# EAGLE design ww101board (EAGLE 8.3.2)

## Sheet 1 of 4: User Interface
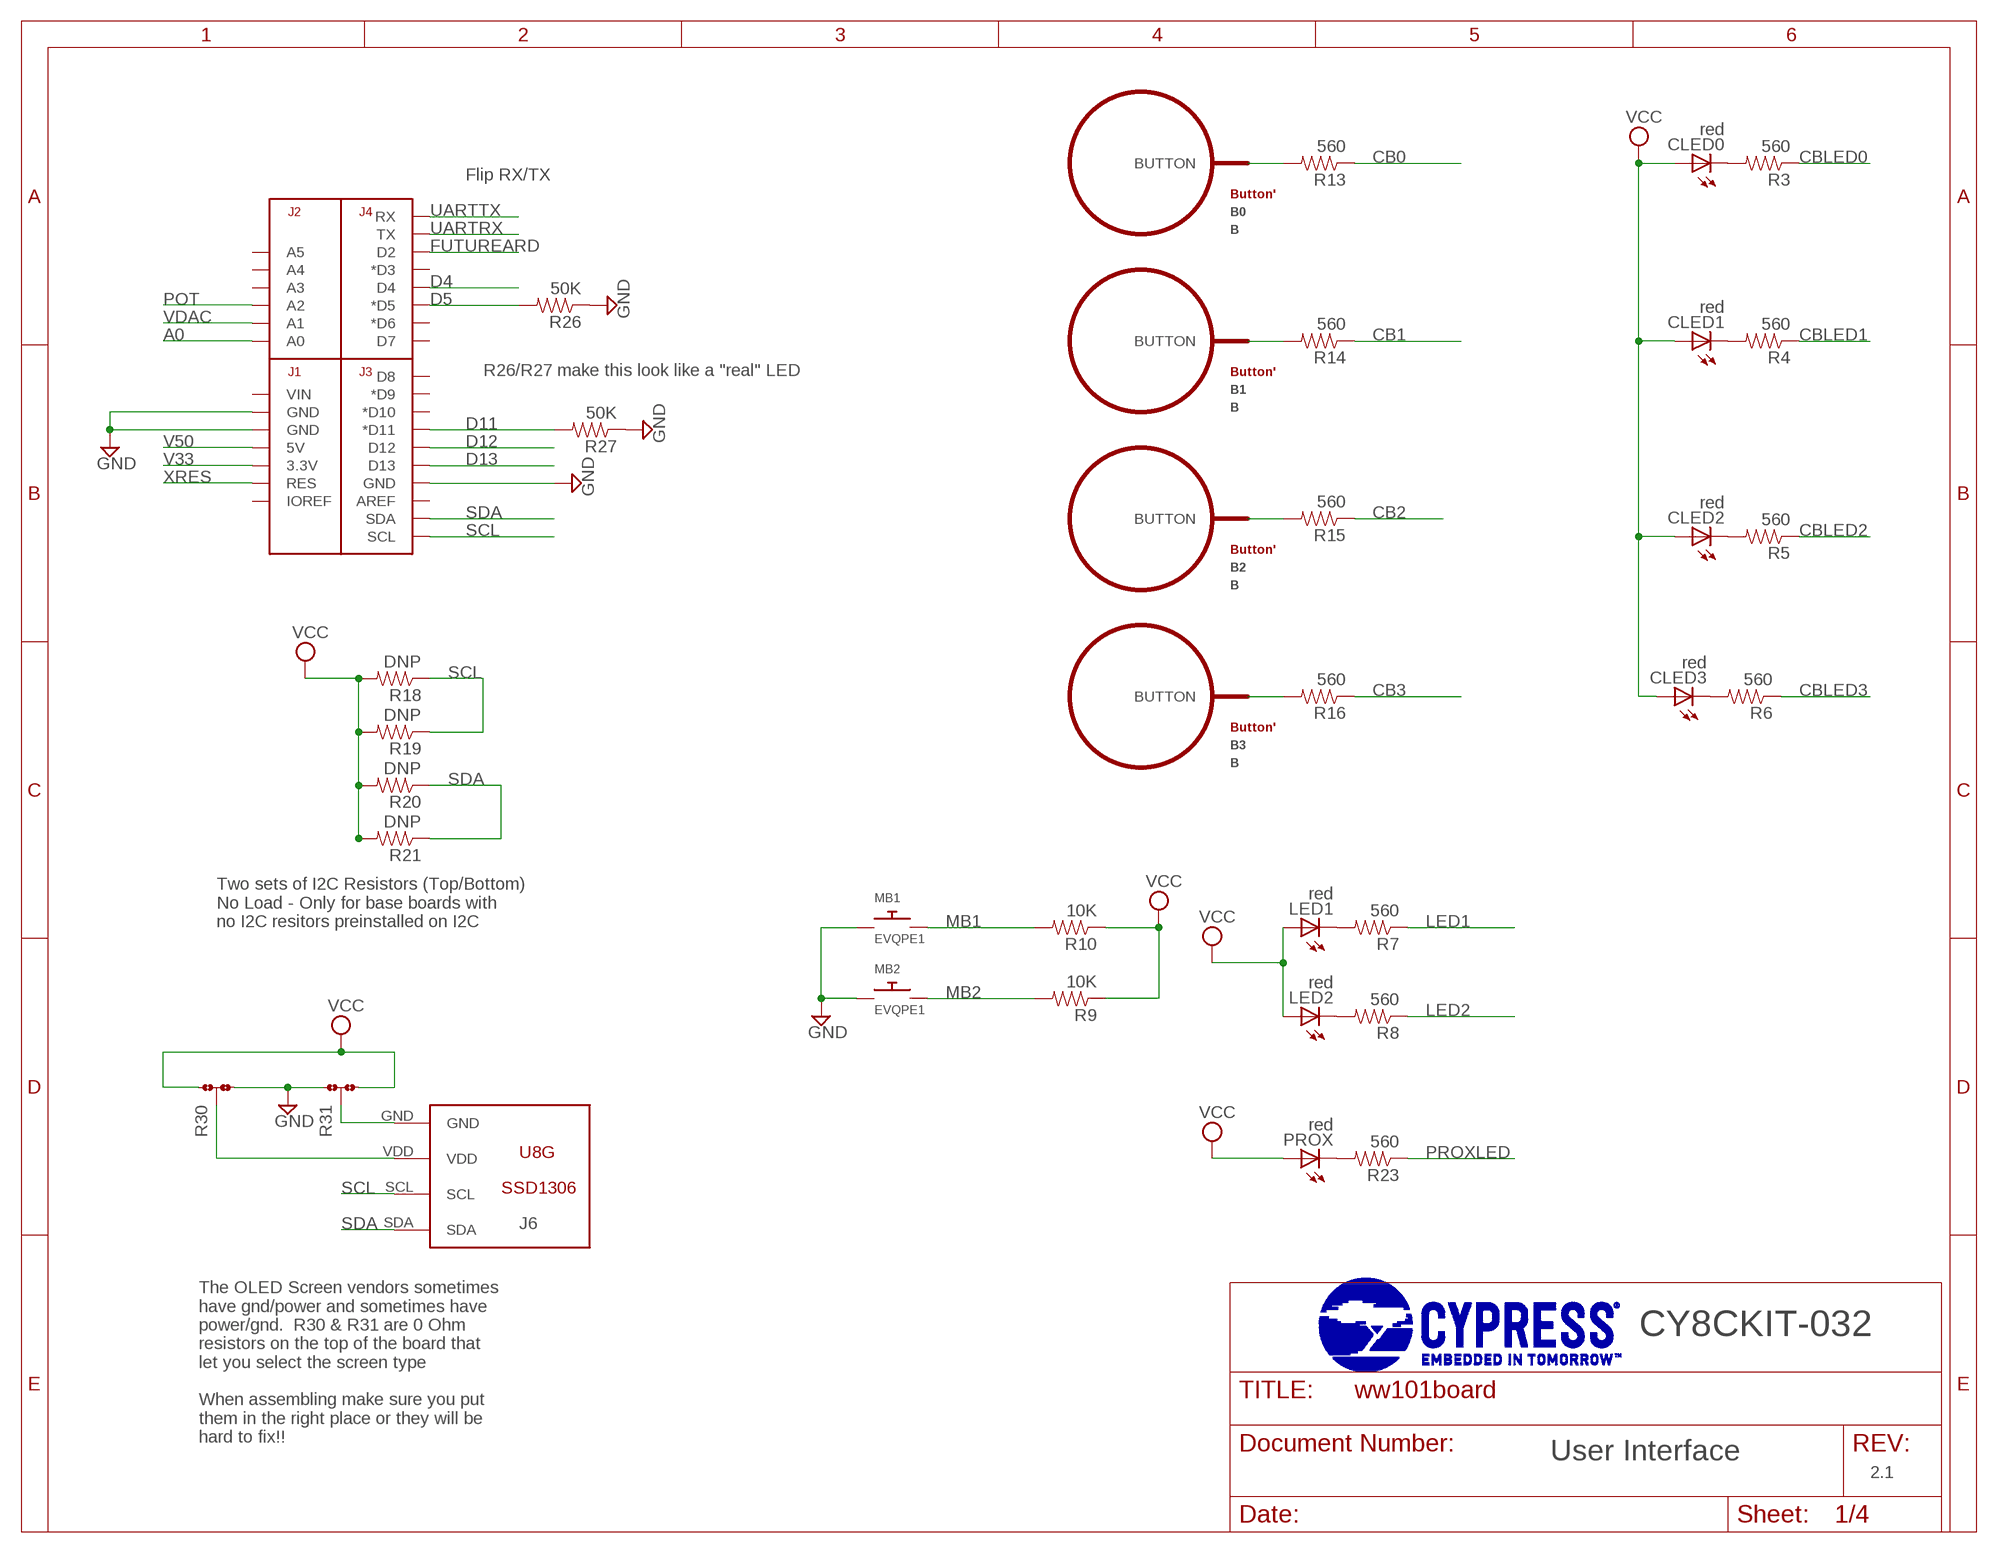
[diagram p0: schematic, sheet 1]

### Parts
B0  B  BUTTON_PASSIVE10MM  [BUTTON_PASSIVE_10MM]
B1  B  BUTTON_PASSIVE10MM  [BUTTON_PASSIVE_10MM]
B2  B  BUTTON_PASSIVE10MM  [BUTTON_PASSIVE_10MM]
B3  B  BUTTON_PASSIVE10MM  [BUTTON_PASSIVE_10MM]
CLED0  red  LEDCHIP-LED0603  [CHIP-LED0603]
CLED1  red  LEDCHIP-LED0603  [CHIP-LED0603]
CLED2  red  LEDCHIP-LED0603  [CHIP-LED0603]
CLED3  red  LEDCHIP-LED0603  [CHIP-LED0603]
J6  U8G-096-OLED  [096-SSD1306]
LED1  red  LEDCHIP-LED0603  [CHIP-LED0603]
LED2  red  LEDCHIP-LED0603  [CHIP-LED0603]
MB1  EVQPE1  [SWITCH]
MB2  EVQPE1  [SWITCH]
PROX  red  LEDCHIP-LED0603  [CHIP-LED0603]
R3  560  RESISTOR0603  [0603-RES]
R4  560  RESISTOR0603  [0603-RES]
R5  560  RESISTOR0603  [0603-RES]
R6  560  RESISTOR0603  [0603-RES]
R7  560  RESISTOR0603  [0603-RES]
R8  560  RESISTOR0603  [0603-RES]
R9  10K  RESISTOR0603  [0603-RES]
R10  10K  RESISTOR0603  [0603-RES]
R13  560  RESISTOR0603  [0603-RES]
R14  560  RESISTOR0603  [0603-RES]
R15  560  RESISTOR0603  [0603-RES]
R16  560  RESISTOR0603  [0603-RES]
R18  DNP  RESISTOR0603  [0603-RES]
R19  DNP  RESISTOR0603  [0603-RES]
R20  DNP  RESISTOR0603  [0603-RES]
R21  DNP  RESISTOR0603  [0603-RES]
R23  560  RESISTOR0603  [0603-RES]
R26  50K  RESISTOR0603  [0603-RES]
R27  50K  RESISTOR0603  [0603-RES]
R30  JMP-3-1_2  [JMP-3-1_2]
R31  JMP-3-2_3  [JMP-3-2_3]
U$1  ARDUINO_R3_SHIELDNOLABELS  [UNO_R3_SHIELD_NOLABELS]

### Nets
A0: U$1.A0 ; also sheet 4
CB0: R13.1 ; also sheet 2
CB1: R14.1 ; also sheet 2
CB2: R15.1 ; also sheet 2
CB3: R16.1 ; also sheet 2
CBLED0: R3.1 ; also sheet 2
CBLED1: R4.1 ; also sheet 2
CBLED2: R5.1 ; also sheet 2
CBLED3: R6.1 ; also sheet 2
D4: U$1.D4 ; also sheet 2
D5: R26.2 U$1.D5(*D5) ; also sheet 2
D11: R27.2 U$1.D11(*D11) ; also sheet 2
D12: U$1.D12 ; also sheet 2
D13: U$1.D13 ; also sheet 2
FUTUREARD: U$1.D2 ; also sheet 2
GND: MB1.P$1 MB2.P$1 R26.1 R27.1 R30.3 R31.1 U$1.GND@0(GND) U$1.GND@1(GND) U$1.GND@2(GND) ; also sheet 2,3,4
LED1: R7.1 ; also sheet 2
LED2: R8.1 ; also sheet 2
MB1: MB1.P$2 R10.2 ; also sheet 2
MB2: MB2.P$2 R9.2 ; also sheet 2
N$2: B0.BUTTON R13.2
N$3: PROX.C R23.2
N$5: B1.BUTTON R14.2
N$7: B2.BUTTON R15.2
N$8: CLED0.C R3.2
N$9: CLED1.C R4.2
N$10: CLED2.C R5.2
N$11: CLED3.C R6.2
N$12: LED1.C R7.2
N$13: LED2.C R8.2
N$14: J6.VDD R30.2
N$15: B3.BUTTON R16.2
N$17: J6.GND R31.2
POT: U$1.A2 ; also sheet 2,4
PROXLED: R23.1 ; also sheet 2
SCL: J6.SCL R18.1 R19.1 U$1.SCL ; also sheet 2
SDA: J6.SDA R20.1 R21.1 U$1.SDA ; also sheet 2
UARTRX: U$1.TX ; also sheet 2
UARTTX: U$1.RX ; also sheet 2
V33: U$1.3.3V ; also sheet 3
V50: U$1.5V ; also sheet 3
VCC: CLED0.A CLED1.A CLED2.A CLED3.A LED1.A LED2.A PROX.A R9.1 R10.1 R18.2 R19.2 R20.2 R21.2 R30.1 R31.3 ; also sheet 2,3,4
VDAC: U$1.A1 ; also sheet 2
XRES: U$1.RES ; also sheet 2
Unconnected: U$1.A3 U$1.A4 U$1.A5 U$1.AREF U$1.D3(*D3) U$1.D6(*D6) U$1.D7 U$1.D8 U$1.D9(*D9) U$1.D10(*D10) U$1.IOREF U$1.VIN

### Notes on the sheet
- Flip RX/TX
- R26/R27 make this look like a "real" LED
- Two sets of I2C Resistors (Top/Bottom)
  No Load - Only for base boards with
  no I2C resitors preinstalled on I2C
- J6
- CY8CKIT-032
- The OLED Screen vendors sometimes
  have gnd/power and sometimes have
  power/gnd.  R30 & R31 are 0 Ohm
  resistors on the top of the board that 
  let you select the screen type
  
  When assembling make sure you put
  them in the right place or they will be
  hard to fix!!
- User Interface
- 2.1

## Sheet 2 of 4: PSoC
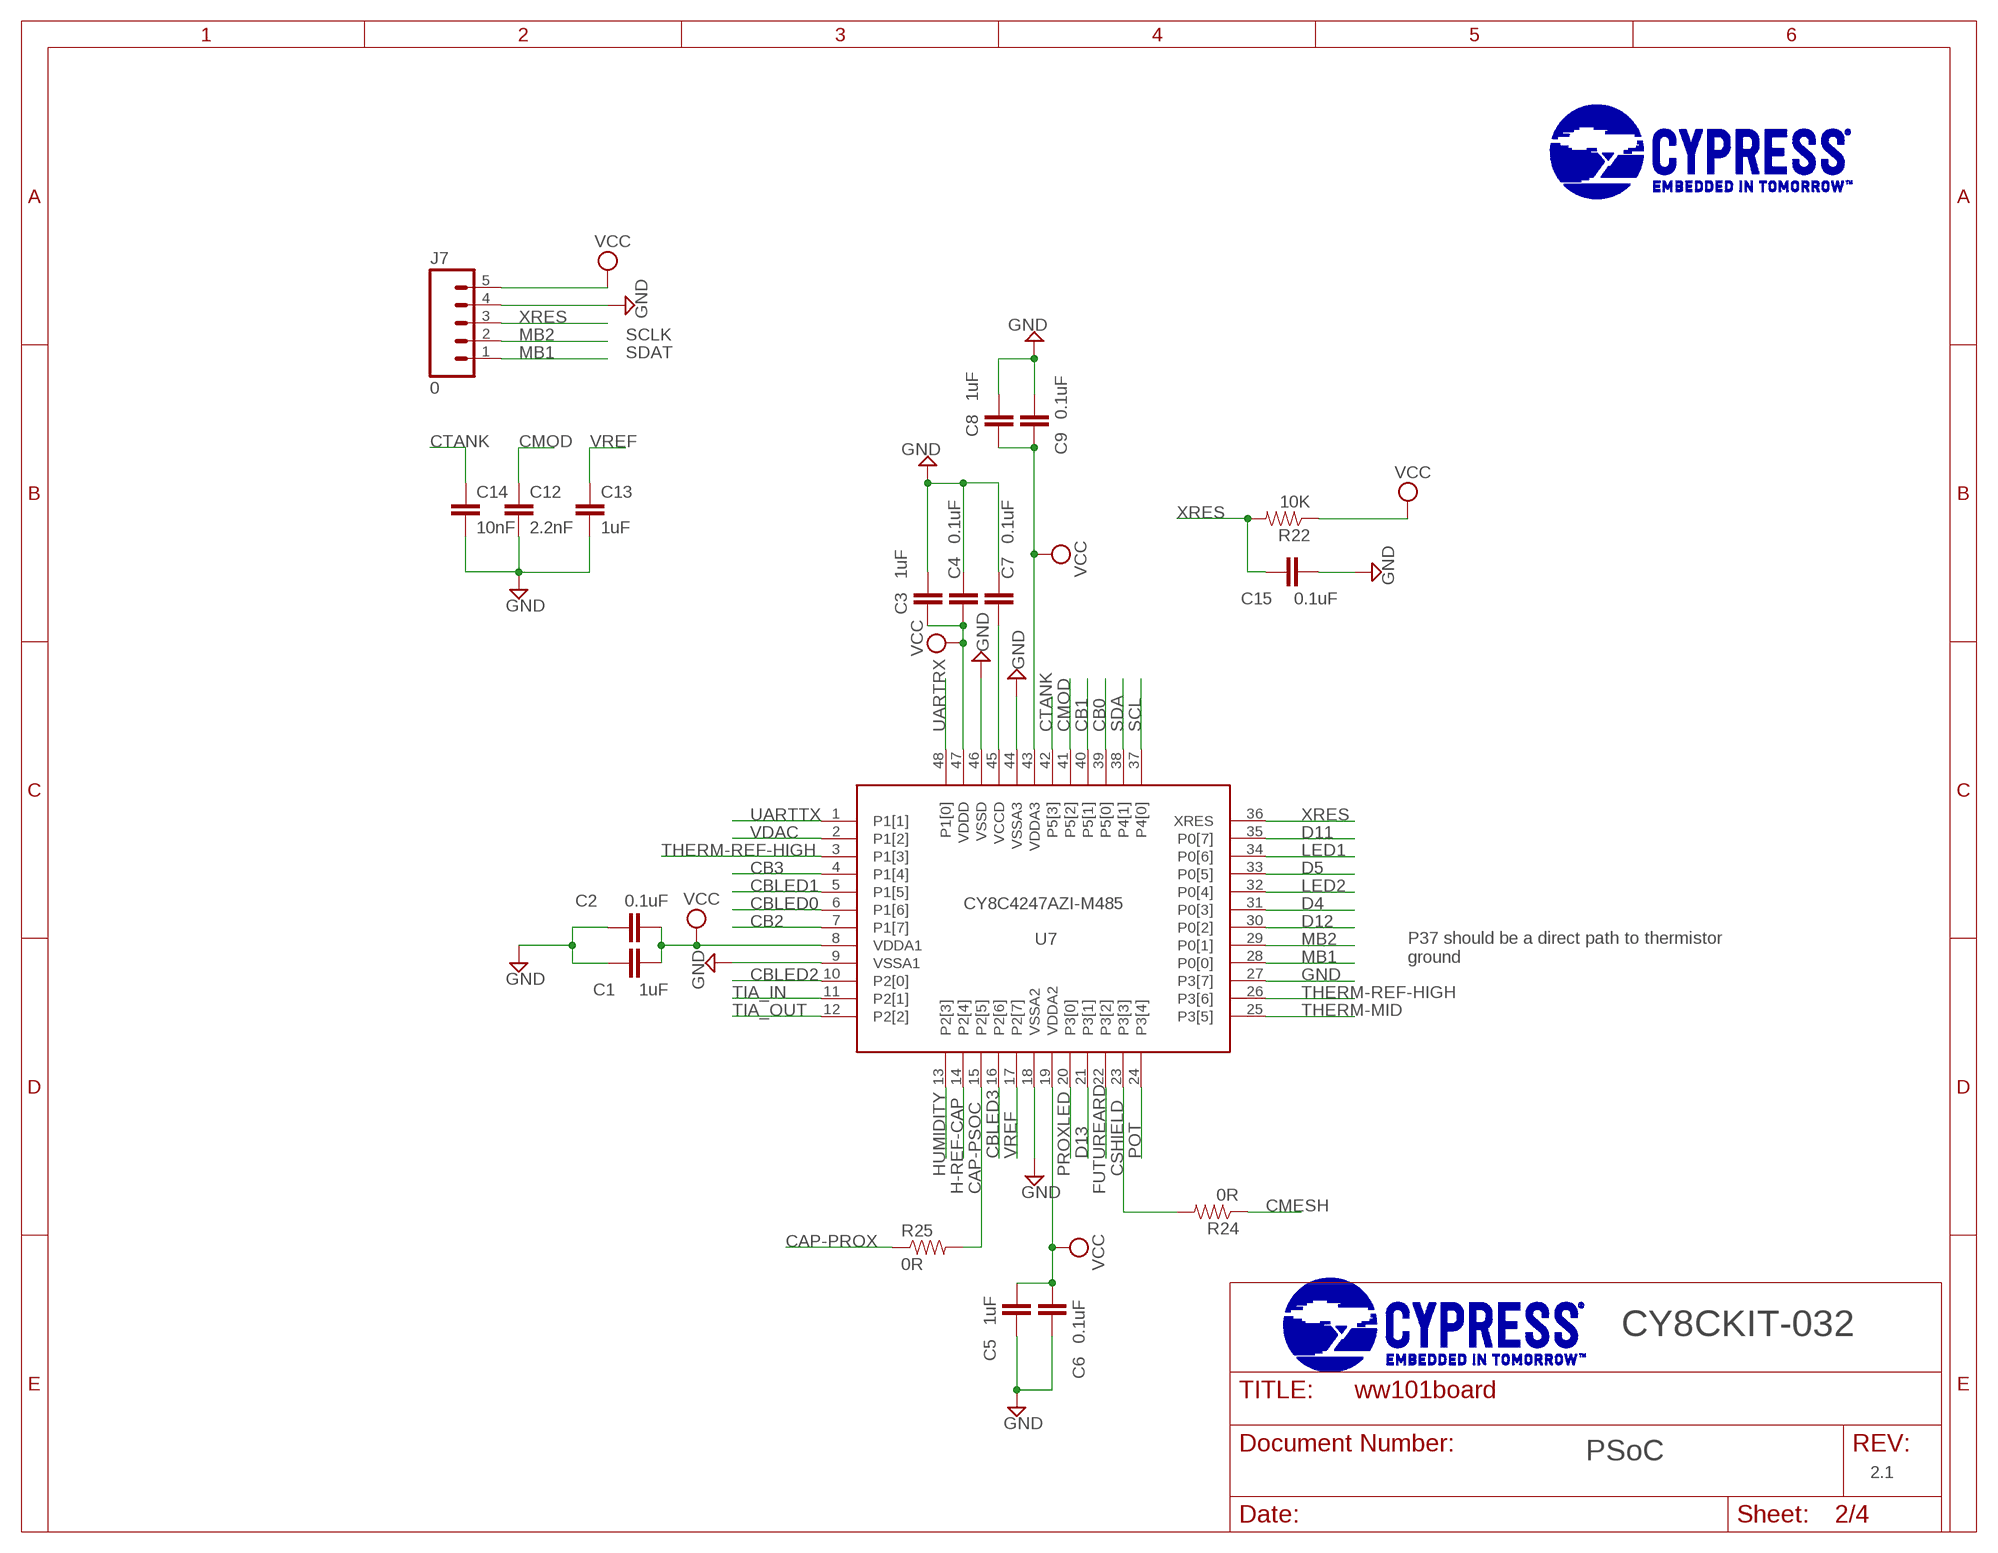
[diagram p1: schematic, sheet 2]

### Parts
C1  1uF  CAP0603-CAP  [0603-CAP]
C2  0.1uF  CAP0603-CAP  [0603-CAP]
C3  1uF  CAP0603-CAP  [0603-CAP]
C4  0.1uF  CAP0603-CAP  [0603-CAP]
C5  1uF  CAP0603-CAP  [0603-CAP]
C6  0.1uF  CAP0603-CAP  [0603-CAP]
C7  0.1uF  CAP0603-CAP  [0603-CAP]
C8  1uF  CAP0603-CAP  [0603-CAP]
C9  0.1uF  CAP0603-CAP  [0603-CAP]
C12  2.2nF  CAP0603-CAP  [0603-CAP]
C13  1uF  CAP0603-CAP  [0603-CAP]
C14  10nF  CAP0603-CAP  [0603-CAP]
C15  0.1uF  CAP0603-CAP  [0603-CAP]
J7  0  M05LOCK  [1X05_LOCK]
R22  10K  RESISTOR0603  [0603-RES]
R24  0R  RESISTOR0603  [0603-RES]
R25  0R  RESISTOR0603  [0603-RES]
U7  CY8C4A45-48  [TQFP-7X7-48]
U$7  CYLOGO-SILK  [CYLOGO-SILK]

### Nets
CAP-PROX: R25.1
CAP-PSOC: R25.2 U7.15(P2[5])
CB0: U7.39(P5[0]) ; also sheet 1
CB1: U7.40(P5[1]) ; also sheet 1
CB2: U7.7(P1[7]) ; also sheet 1
CB3: U7.4(P1[4]) ; also sheet 1
CBLED0: U7.6(P1[6]) ; also sheet 1
CBLED1: U7.5(P1[5]) ; also sheet 1
CBLED2: U7.10(P2[0]) ; also sheet 1
CBLED3: U7.16(P2[6]) ; also sheet 1
CMESH: R24.1
CMOD: C12.1 U7.41(P5[2])
CSHIELD: R24.2 U7.23(P3[3])
CTANK: C14.1 U7.42(P5[3])
D4: U7.31(P0[3]) ; also sheet 1
D5: U7.33(P0[5]) ; also sheet 1
D11: U7.35(P0[7]) ; also sheet 1
D12: U7.30(P0[2]) ; also sheet 1
D13: U7.21(P3[1]) ; also sheet 1
FUTUREARD: U7.22(P3[2]) ; also sheet 1
GND: C1.1 C2.1 C3.1 C4.1 C5.2 C6.2 C7.1 C8.1 C9.1 C12.2 C13.2 C14.2 C15.1 J7.4 U7.9(VSSA1) U7.18(VSSA2) U7.27(P3[7]) U7.44(VSSA3) U7.46(VSSD) ; also sheet 1,3,4
H-REF-CAP: U7.14(P2[4]) ; also sheet 4
HUMIDITY: U7.13(P2[3]) ; also sheet 4
LED1: U7.34(P0[6]) ; also sheet 1
LED2: U7.32(P0[4]) ; also sheet 1
MB1: J7.1 U7.28(P0[0]) ; also sheet 1
MB2: J7.2 U7.29(P0[1]) ; also sheet 1
N$20: C7.2 U7.45(VCCD)
POT: U7.24(P3[4]) ; also sheet 1,4
PROXLED: U7.20(P3[0]) ; also sheet 1
SCL: U7.37(P4[0]) ; also sheet 1
SDA: U7.38(P4[1]) ; also sheet 1
THERM-MID: U7.25(P3[5]) ; also sheet 4
THERM-REF-HIGH: U7.3(P1[3]) U7.26(P3[6]) ; also sheet 4
TIA_IN: U7.11(P2[1]) ; also sheet 4
TIA_OUT: U7.12(P2[2]) ; also sheet 4
UARTRX: U7.48(P1[0]) ; also sheet 1
UARTTX: U7.1(P1[1]) ; also sheet 1
VCC: C1.2 C2.2 C3.2 C4.2 C5.1 C6.1 C8.2 C9.2 J7.5 R22.1 U7.8(VDDA1) U7.19(VDDA2) U7.43(VDDA3) U7.47(VDDD) ; also sheet 1,3,4
VDAC: U7.2(P1[2]) ; also sheet 1
VREF: C13.1 U7.17(P2[7])
XRES: C15.2 J7.3 R22.2 U7.36(XRES) ; also sheet 1

### Notes on the sheet
- SCLK
- SDAT
- CY8C4247AZI-M485
- U7
- P37 should be a direct path to thermistor
  ground
- CY8CKIT-032
- PSoC
- 2.1

## Sheet 3 of 4: Power
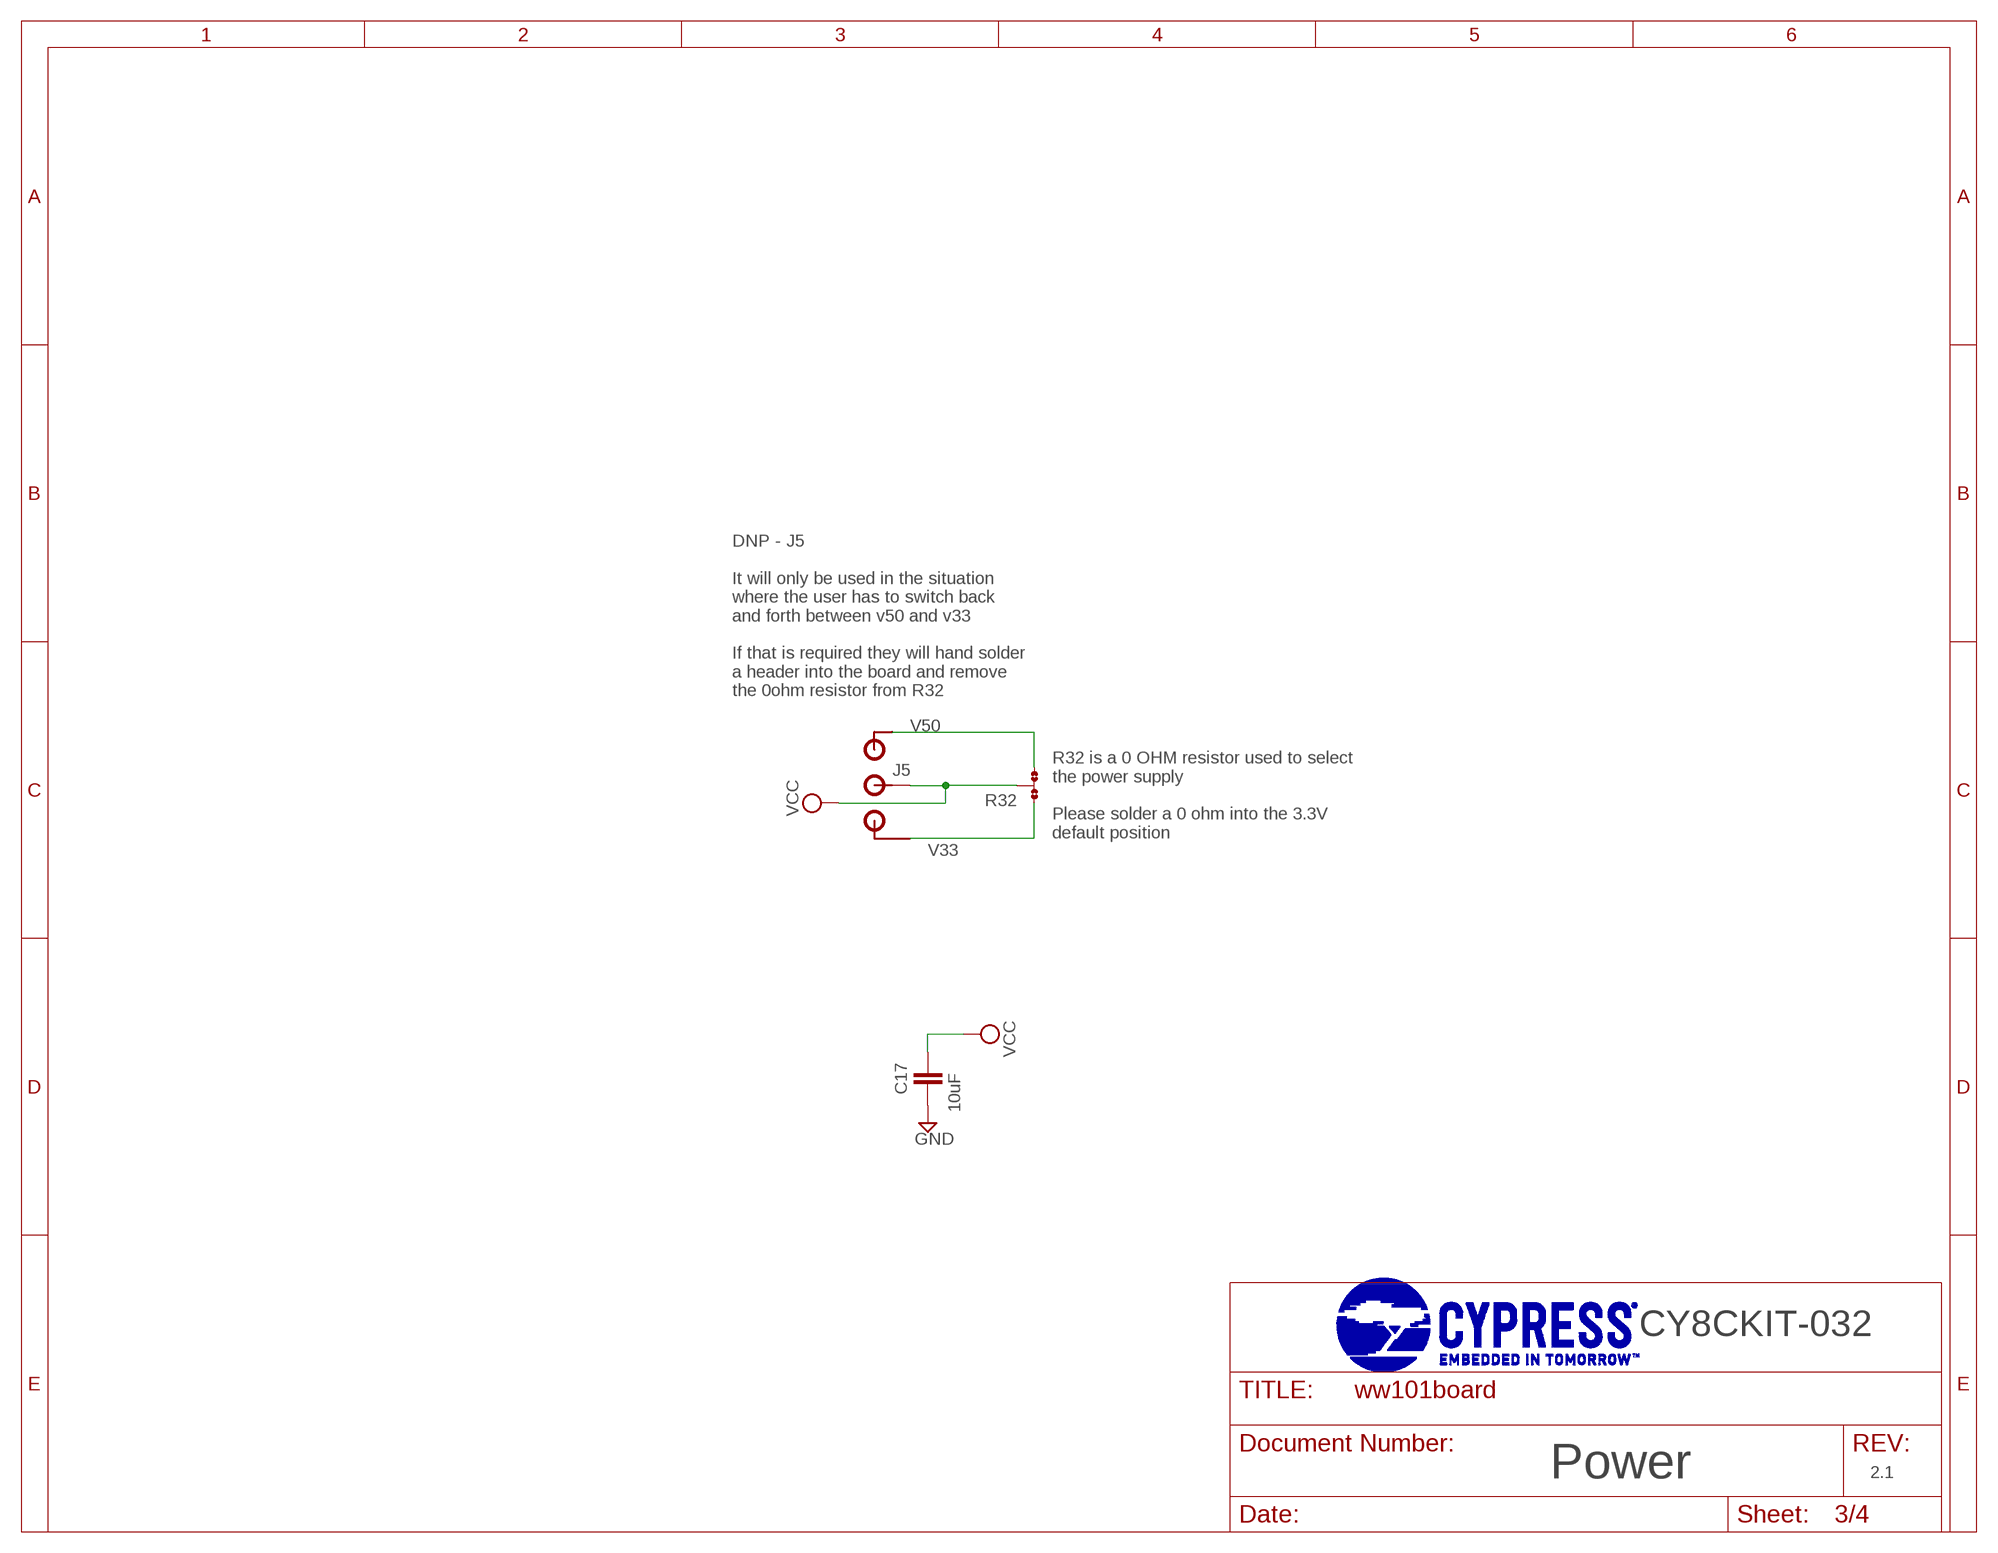
[diagram p2: schematic, sheet 3]

### Parts
C17  10uF  CAP0603-CAP  [0603-CAP]
J5  JMP-3-PTH-PTH  [JMP-3-NO-PTH-2.54]
R32  JMP-3-NO  [JMP-3-NO]

### Nets
GND: C17.2 ; also sheet 1,2,4
V33: J5.3 R32.1 ; also sheet 1
V50: J5.1 R32.3 ; also sheet 1
VCC: C17.1 J5.2 R32.2 ; also sheet 1,2,4

### Notes on the sheet
- DNP - J5
  
  It will only be used in the situation
  where the user has to switch back
  and forth between v50 and v33
  
  If that is required they will hand solder
  a header into the board and remove
  the 0ohm resistor from R32
- R32 is a 0 OHM resistor used to select
  the power supply
  
  Please solder a 0 ohm into the 3.3V
  default position
- CY8CKIT-032
- Power | 2.1

## Sheet 4 of 4: Sensor
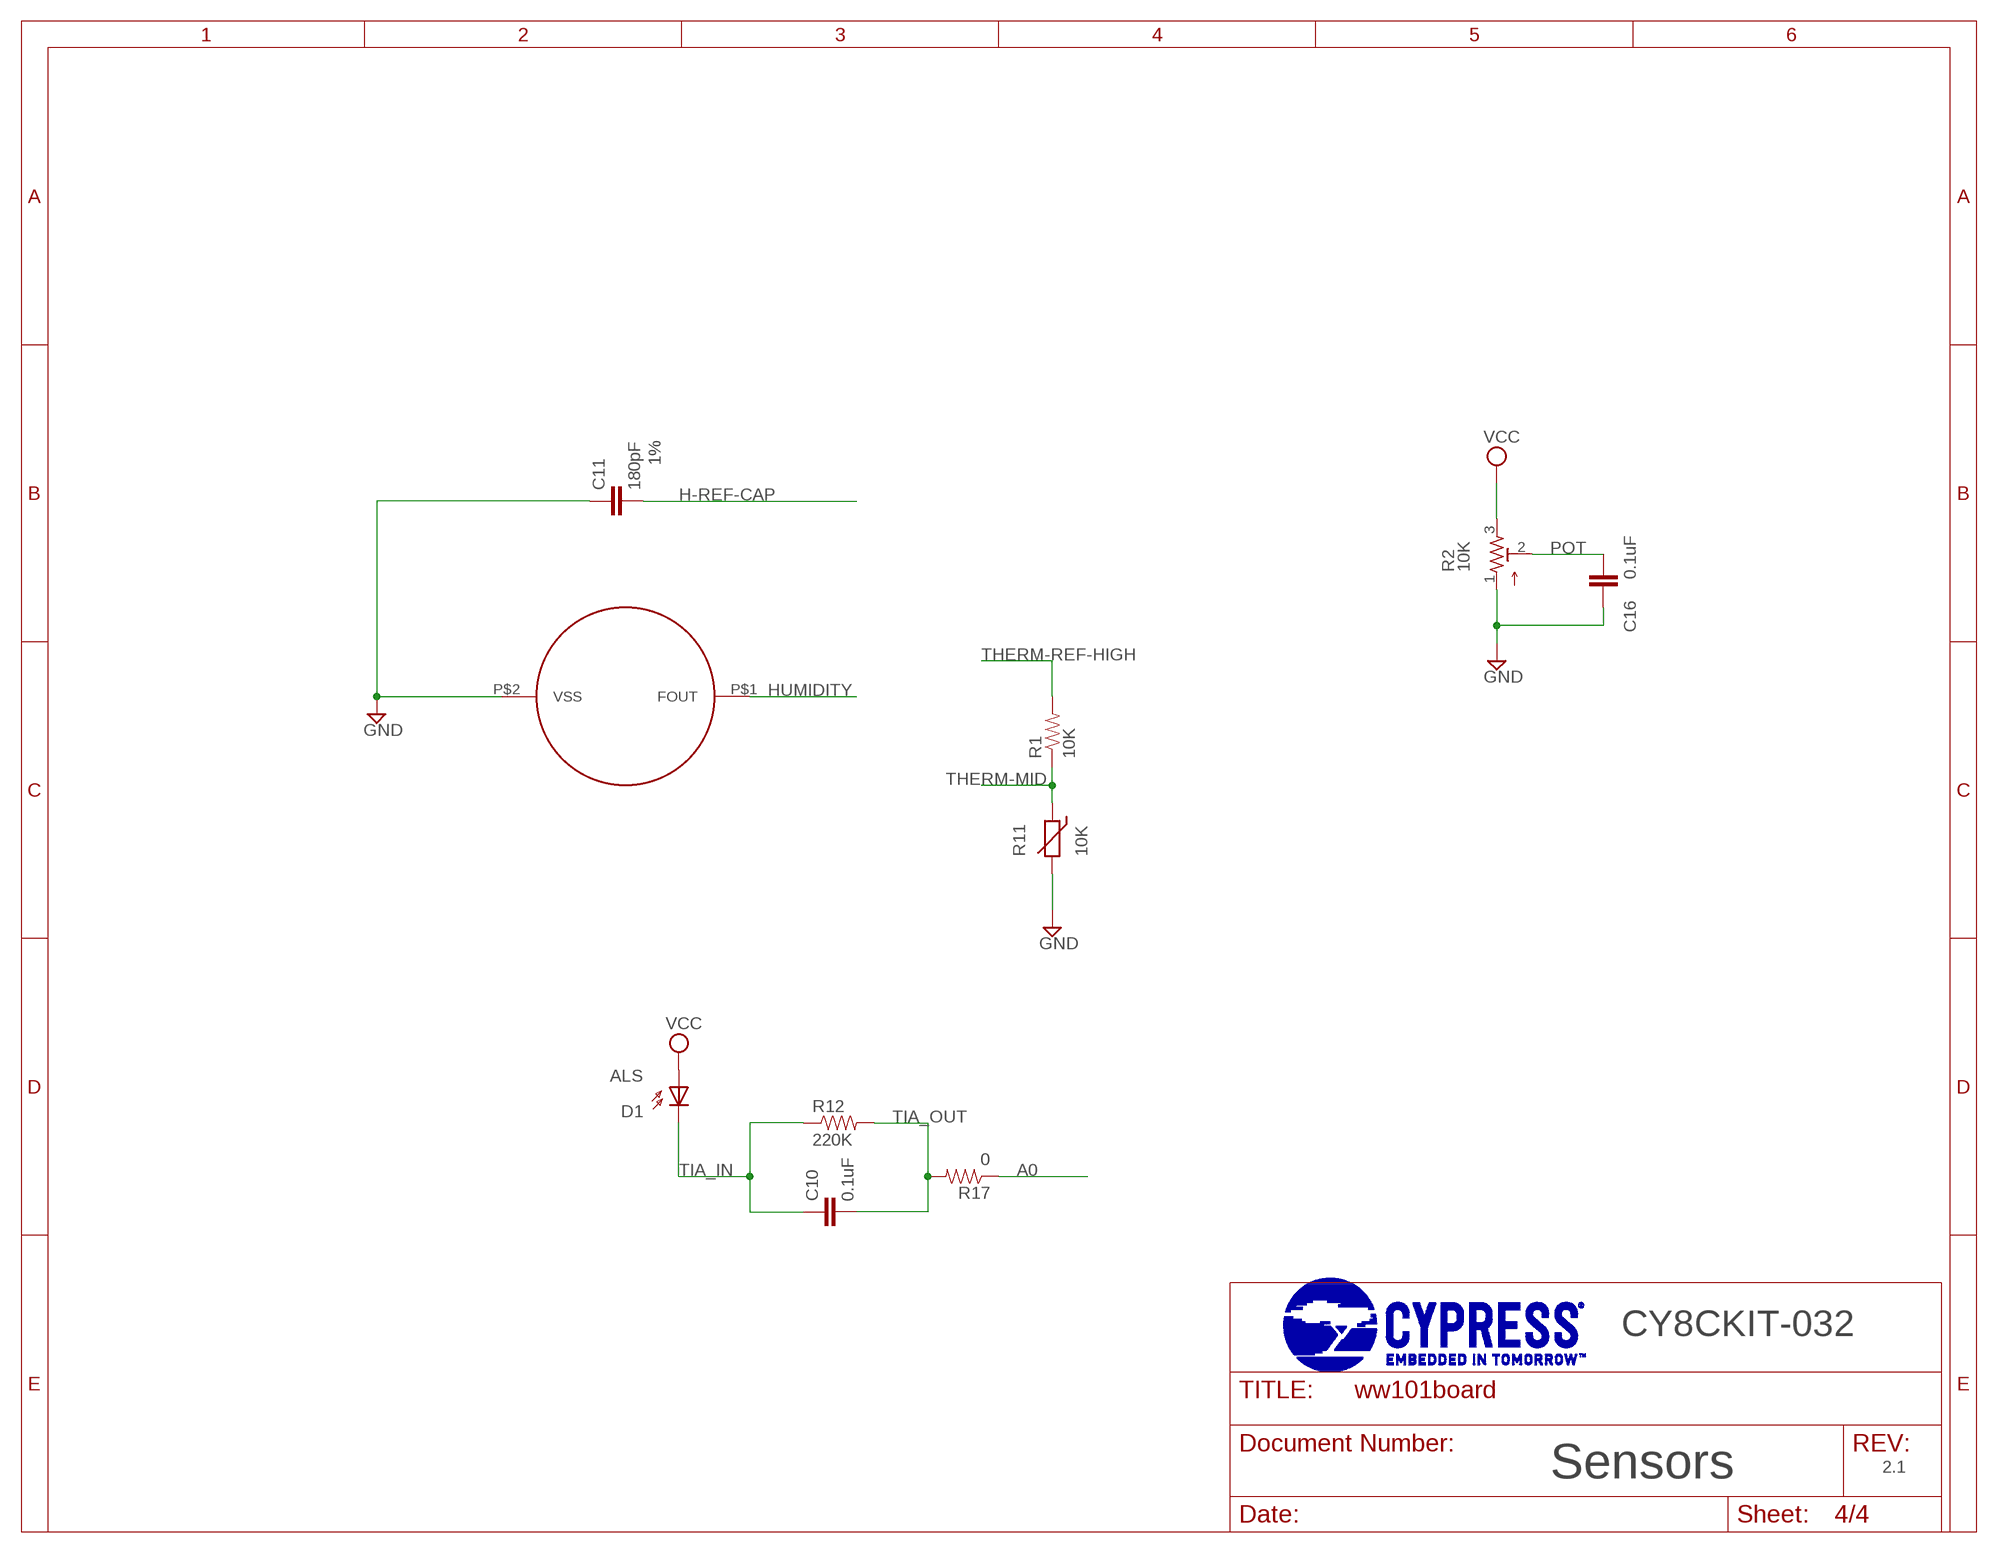
[diagram p3: schematic, sheet 4]

### Parts
C10  0.1uF  CAP0603-CAP  [0603-CAP]
C11  180pF  CAP0603-CAP  [0603-CAP]
C16  0.1uF  CAP0603-CAP  [0603-CAP]
D1  ALS  [ALS]
HUMIDITY  HPP801A031  [HUMIDITY]
R1  10K  RESISTOR0603  [0603-RES]
R2  10K  TRIM_US-3386P  [3386P]
R11  THERMISTOR-5  [R-5]
R12  220K  RESISTOR0603  [0603-RES]
R17  0  RESISTOR0603  [0603-RES]

### Nets
A0: R17.1 ; also sheet 1
GND: C11.1 C16.2 HUMIDITY.P$2(VSS) R2.1 R11.2 ; also sheet 1,2,3
H-REF-CAP: C11.2 ; also sheet 2
HUMIDITY: HUMIDITY.P$1(FOUT) ; also sheet 2
POT: C16.1 R2.2 ; also sheet 1,2
THERM-MID: R1.1 R11.1 ; also sheet 2
THERM-REF-HIGH: R1.2 ; also sheet 2
TIA_IN: C10.1 D1.CATHODE(C1) R12.1 ; also sheet 2
TIA_OUT: C10.2 R12.2 R17.2 ; also sheet 2
VCC: D1.ANNODE(E1) R2.3 ; also sheet 1,2,3

### Notes on the sheet
- 1%
- 10K
- CY8CKIT-032
- 2.1
- Sensors

## Library data of the parts
B0 B1-B3 = ww101board:BUTTON_PASSIVE: Button, Passive Capacitive/Touch Sensing Type Source : http://www.PatternAgents.com Github : https://github.com/PatternAgents License : http://creativecommons.org/licenses/by-sa/3.1/ (Creative Commons 3.1) THIS SOFTWARE IS PROVIDED BY THE CONTRIBUTORS "AS IS" AND WITHOUT ANY EXPRESS OR IMPLIED WARRANTIES, INCLUDING, BUT NOT LIMITED TO, THE IMPLIED WARRANTIES OF MERCHANTABILITY AND FITNESS FOR A PARTICULAR PURPOSE ARE DISCLAIMED. IN NO EVENT SHALL THE COPYRIGHT OWNER OR CONTRIBUTORS BE LIABLE FOR ANY DIRECT, INDIRECT, INCIDENTAL, SPECIAL, EXEMPLARY, OR CONSEQUENTIAL DAMAGES (INCLUDING, BUT NOT LIMITED TO, PROCUREMENT OF SUBSTITUTE GOODS OR SERVICES; LOSS OF USE, DATA, OR PROFITS; OR BUSINESS INTERRUPTION) HOWEVER CAUSED AND ON ANY THEORY OF LIABILITY, WHETHER IN CONTRACT, STRICT LIABILITY, OR TORT (INCLUDING NEGLIGENCE OR OTHERWISE) ARISING IN ANY WAY OUT OF THE USE OF THIS SOFTWARE, EVEN IF ADVISED OF THE POSSIBILITY OF SUCH DAMAGE.
C1-C17 = ww101board:CAP: Capacitor Standard 0603 ceramic capacitor, and 0.1" leaded capacitor.
CLED0 CLED1-CLED3 LED1 LED2 PROX = ww101board:LED: LED OSRAM: - CHIPLED LG R971, LG N971, LY N971, LG Q971, LY Q971, LO R971, LY R971 LH N974, LH R974 LS Q976, LO Q976, LY Q976 LO Q996 - Hyper CHIPLED LW Q18S LB Q993, LB Q99A, LB R99A - SideLED LS A670, LO A670, LY A670, LG A670, LP A670 LB A673, LV A673, LT A673, LW A673 LH A674 LY A675 LS A676, LA A676, LO A676, LY A676, LW A676 LS A679, LY A679, LG A679 - Hyper Micro SIDELED® LS Y876, LA Y876, LO Y876, LY Y876 LT Y87S - SmartLED LW L88C, LW L88S LB L89C, LB L89S, LG L890 LS L89K, LO L89K, LY L89K LS L896, LA L896, LO L896, LY L896 - TOPLED LS T670, LO T670, LY T670, LG T670, LP T670 LSG T670, LSP T670, LSY T670, LOP T670, LYG T670 LG T671, LOG T671, LSG T671 LB T673, LV T673, LT T673, LW T673 LH T674 LS T676, LA T676, LO T676, LY T676, LB T676, LH T676, LSB T676, LW T676 LB T67C, LV T67C, LT T67C, LS T67K, LO T67K, LY T67K, LW E67C LS E67B, LA E67B, LO E67B, LY E67B, LB E67C, LV E67C, LT E67C LW T67C LS T679, LY T679, LG T679 LS T770, LO T770, LY T770, LG T770, LP T770 LB T773, LV T773, LT T773, LW T773 LH T774 LS E675, LA E675, LY E675, LS T675 LS T776, LA T776, LO T776, LY T776, LB T776 LHGB T686 LT T68C, LB T68C - Hyper Mini TOPLED® LB M676 - Mini TOPLED Santana® LG M470 LS M47K, LO M47K, LY M47K Source: http://www.osram.convergy.de/
D1 = ww101board:ALS: Ambient Light Sensor Vishay TEMD6200FX01 http://www.vishay.com/docs/81812/temd6200.pdf
HUMIDITY = ww101board:HPP801A031
J5 = ww101board:JMP-3-PTH: Three Terminal Jumper - Normally Open All Pads Open (unconnected) PatternAgents ProtoPads Library Schematic and PCB layout libraries for design patterns by PatternAgents. For the CADSoft Eagle CAD program : http://www.cadsoftusa.com/download-eagle/ Source LBR : http://www.patternagents.com Github : https://github.com/PatternAgents License : http://creativecommons.org/licenses/by-sa/4.0/ (Creative Commons 4.0) THIS SOFTWARE IS PROVIDED BY THE CONTRIBUTORS "AS IS" AND WITHOUT ANY EXPRESS OR IMPLIED WARRANTIES, INCLUDING, BUT NOT LIMITED TO, THE IMPLIED WARRANTIES OF MERCHANTABILITY AND FITNESS FOR A PARTICULAR PURPOSE ARE DISCLAIMED. IN NO EVENT SHALL THE COPYRIGHT OWNER OR CONTRIBUTORS BE LIABLE FOR ANY DIRECT, INDIRECT, INCIDENTAL, SPECIAL, EXEMPLARY, OR CONSEQUENTIAL DAMAGES (INCLUDING, BUT NOT LIMITED TO, PROCUREMENT OF SUBSTITUTE GOODS OR SERVICES; LOSS OF USE, DATA, OR PROFITS; OR BUSINESS INTERRUPTION) HOWEVER CAUSED AND ON ANY THEORY OF LIABILITY, WHETHER IN CONTRACT, STRICT LIABILITY, OR TORT (INCLUDING NEGLIGENCE OR OTHERWISE) ARISING IN ANY WAY OUT OF THE USE OF THIS SOFTWARE, EVEN IF ADVISED OF THE POSSIBILITY OF SUCH DAMAGE.
J6 = ww101board:U8G-096-OLED
J7 = ww101board:M05: Header 5 Standard 5-pin 0.1" header. Use with straight break away headers (SKU : PRT-00116), right angle break away headers (PRT-00553), swiss pins (PRT-00743), machine pins (PRT-00117), and female headers (PRT-00115). Molex polarized connector foot print use with SKU : PRT-08230 with associated crimp pins and housings.
MB1 MB2 = ww101board:EVQPE1
R1 R3-R10 R12-R27 = ww101board:RESISTOR: Resistor Basic schematic elements and footprints for 0603, 1206, and PTH resistors.
R2 = ww101board:TRIM_US-: POTENTIOMETER
R11 = ww101board:THERMISTOR: THERMISTOR
R30 = ww101board:JMP-3-1_2: Three Terminal Jumper - 1 & 2 Connected Positions 1and 2 are normally connected. PatternAgents ProtoPads Library Schematic and PCB layout libraries for design patterns by PatternAgents. For the CADSoft Eagle CAD program : http://www.cadsoftusa.com/download-eagle/ Source LBR : http://www.patternagents.com Github : https://github.com/PatternAgents License : http://creativecommons.org/licenses/by-sa/4.0/ (Creative Commons 4.0) THIS SOFTWARE IS PROVIDED BY THE CONTRIBUTORS "AS IS" AND WITHOUT ANY EXPRESS OR IMPLIED WARRANTIES, INCLUDING, BUT NOT LIMITED TO, THE IMPLIED WARRANTIES OF MERCHANTABILITY AND FITNESS FOR A PARTICULAR PURPOSE ARE DISCLAIMED. IN NO EVENT SHALL THE COPYRIGHT OWNER OR CONTRIBUTORS BE LIABLE FOR ANY DIRECT, INDIRECT, INCIDENTAL, SPECIAL, EXEMPLARY, OR CONSEQUENTIAL DAMAGES (INCLUDING, BUT NOT LIMITED TO, PROCUREMENT OF SUBSTITUTE GOODS OR SERVICES; LOSS OF USE, DATA, OR PROFITS; OR BUSINESS INTERRUPTION) HOWEVER CAUSED AND ON ANY THEORY OF LIABILITY, WHETHER IN CONTRACT, STRICT LIABILITY, OR TORT (INCLUDING NEGLIGENCE OR OTHERWISE) ARISING IN ANY WAY OUT OF THE USE OF THIS SOFTWARE, EVEN IF ADVISED OF THE POSSIBILITY OF SUCH DAMAGE.; BOM: EXCLUDE
R31 = ww101board:JMP-3-2_3: Three Terminal Jumper - 2 & 3 Connected Positions 2 and 3 are normally connected. PatternAgents ProtoPads Library Schematic and PCB layout libraries for design patterns by PatternAgents. For the CADSoft Eagle CAD program : http://www.cadsoftusa.com/download-eagle/ Source LBR : http://www.patternagents.com Github : https://github.com/PatternAgents License : http://creativecommons.org/licenses/by-sa/4.0/ (Creative Commons 4.0) THIS SOFTWARE IS PROVIDED BY THE CONTRIBUTORS "AS IS" AND WITHOUT ANY EXPRESS OR IMPLIED WARRANTIES, INCLUDING, BUT NOT LIMITED TO, THE IMPLIED WARRANTIES OF MERCHANTABILITY AND FITNESS FOR A PARTICULAR PURPOSE ARE DISCLAIMED. IN NO EVENT SHALL THE COPYRIGHT OWNER OR CONTRIBUTORS BE LIABLE FOR ANY DIRECT, INDIRECT, INCIDENTAL, SPECIAL, EXEMPLARY, OR CONSEQUENTIAL DAMAGES (INCLUDING, BUT NOT LIMITED TO, PROCUREMENT OF SUBSTITUTE GOODS OR SERVICES; LOSS OF USE, DATA, OR PROFITS; OR BUSINESS INTERRUPTION) HOWEVER CAUSED AND ON ANY THEORY OF LIABILITY, WHETHER IN CONTRACT, STRICT LIABILITY, OR TORT (INCLUDING NEGLIGENCE OR OTHERWISE) ARISING IN ANY WAY OUT OF THE USE OF THIS SOFTWARE, EVEN IF ADVISED OF THE POSSIBILITY OF SUCH DAMAGE.; BOM: EXCLUDE
R32 = ww101board:JMP-3-NO: Three Terminal Jumper - Normally Open All Pads Open (unconnected) PatternAgents ProtoPads Library Schematic and PCB layout libraries for design patterns by PatternAgents. For the CADSoft Eagle CAD program : http://www.cadsoftusa.com/download-eagle/ Source LBR : http://www.patternagents.com Github : https://github.com/PatternAgents License : http://creativecommons.org/licenses/by-sa/4.0/ (Creative Commons 4.0) THIS SOFTWARE IS PROVIDED BY THE CONTRIBUTORS "AS IS" AND WITHOUT ANY EXPRESS OR IMPLIED WARRANTIES, INCLUDING, BUT NOT LIMITED TO, THE IMPLIED WARRANTIES OF MERCHANTABILITY AND FITNESS FOR A PARTICULAR PURPOSE ARE DISCLAIMED. IN NO EVENT SHALL THE COPYRIGHT OWNER OR CONTRIBUTORS BE LIABLE FOR ANY DIRECT, INDIRECT, INCIDENTAL, SPECIAL, EXEMPLARY, OR CONSEQUENTIAL DAMAGES (INCLUDING, BUT NOT LIMITED TO, PROCUREMENT OF SUBSTITUTE GOODS OR SERVICES; LOSS OF USE, DATA, OR PROFITS; OR BUSINESS INTERRUPTION) HOWEVER CAUSED AND ON ANY THEORY OF LIABILITY, WHETHER IN CONTRACT, STRICT LIABILITY, OR TORT (INCLUDING NEGLIGENCE OR OTHERWISE) ARISING IN ANY WAY OUT OF THE USE OF THIS SOFTWARE, EVEN IF ADVISED OF THE POSSIBILITY OF SUCH DAMAGE.
U7 = ww101board:CY8C4A45-48
U$1 = ww101board:ARDUINO_R3_SHIELD: Shield form compatible with the Arduino Uno R3.
U$7 = ww101board:CYLOGO-SILK

## Board
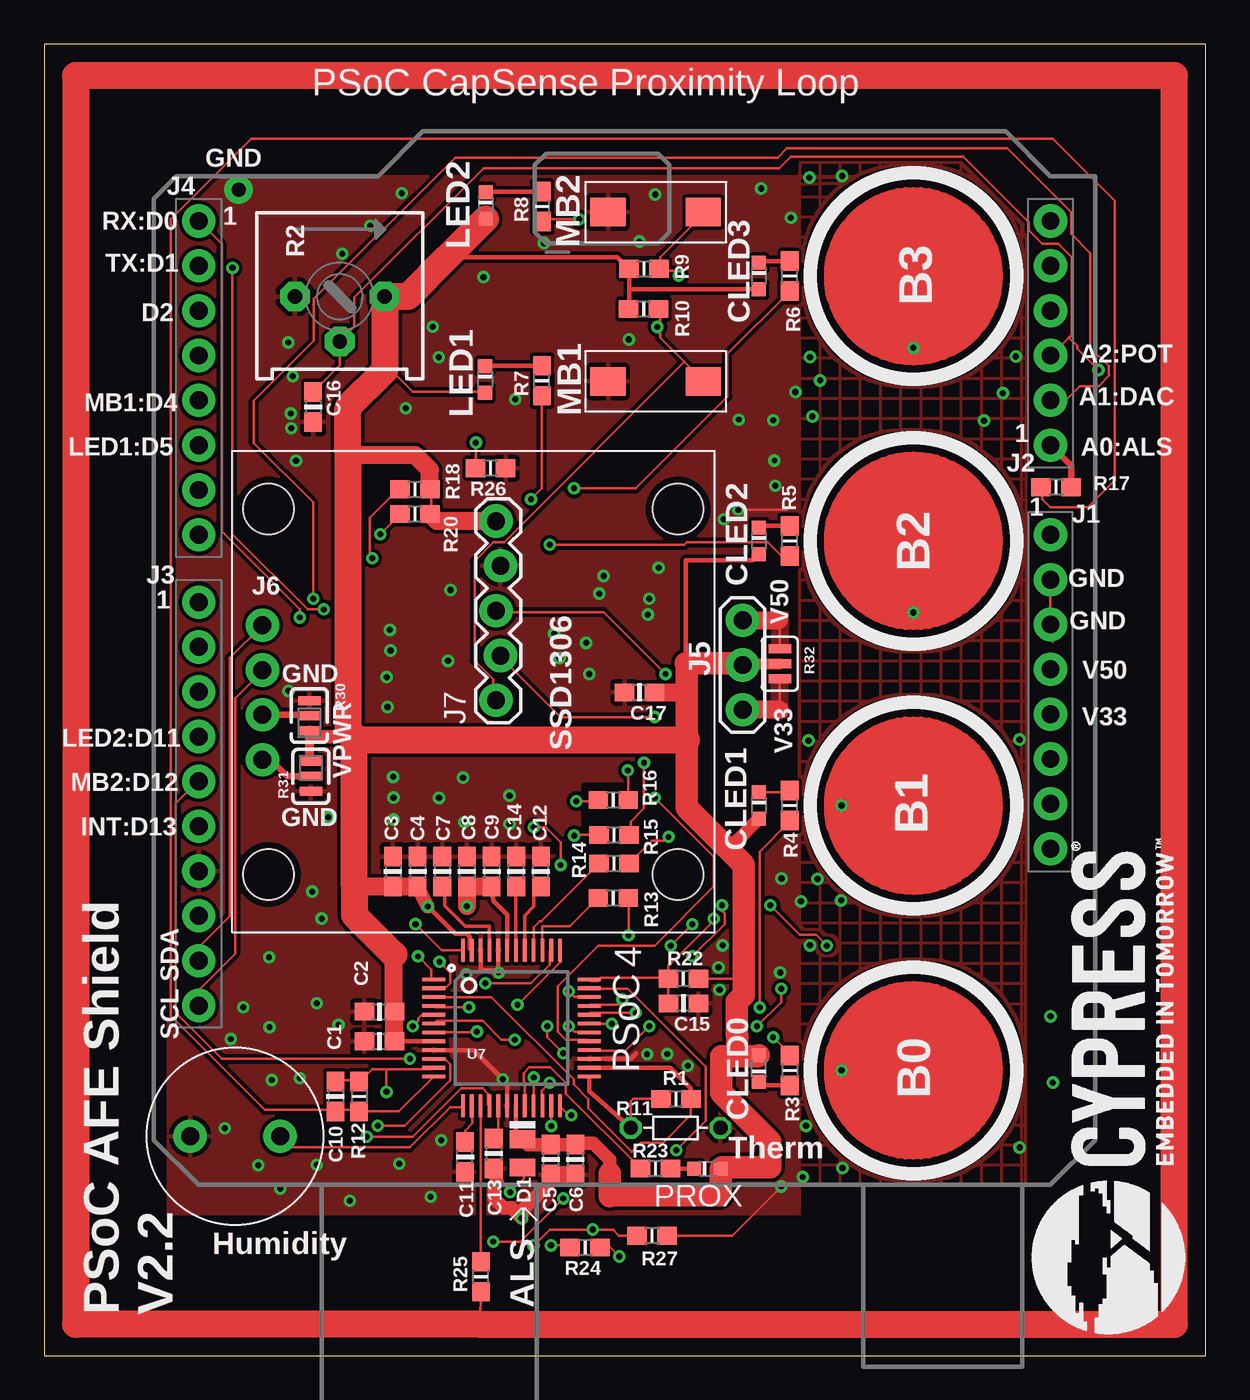
[diagram p4: board, top side]
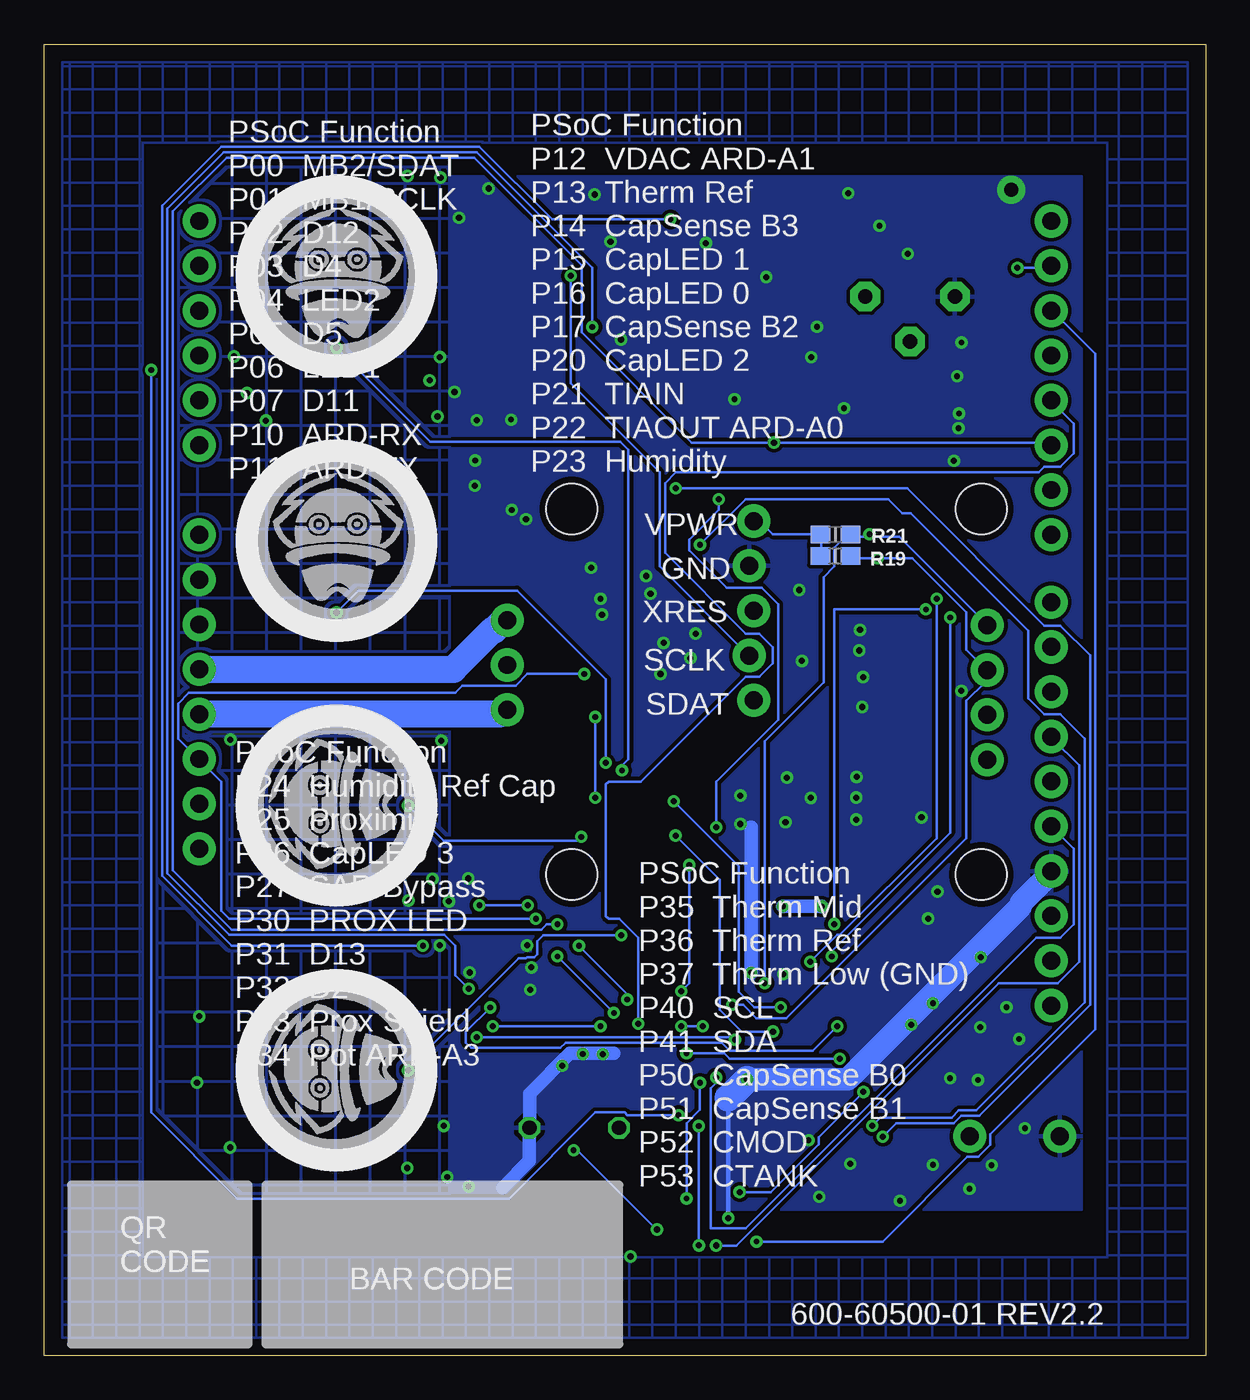
[diagram p5: board, bottom side, seen from below]

Size 65.81 x 74.32 mm. Coordinates in mm from the lower left corner, seen from the top.
Outline: 0,0 65.81,0 65.81,74.32 0,74.32 0,0
Copper layers (1*16): Top 0.0356mm / dielectric 1.5011mm / Bottom 0.0356mm
Design rules "oshpark-2layer *": minimum track width 6mil, minimum drill 13mil, track to track 6mil, track to pad 6mil, pad to pad 6mil, via to via 6mil, smd to smd 6mil, copper to edge 15mil, drill to drill 6mil, minimum pad ring 7mil, minimum via ring 7mil, stop-mask expansion 2.5mil, vias tented up to drill 15mil, thermal gap 10mil
tRestrict: area 30.6,24.9 to 34.2,32.3; 1 lines
bRestrict: area -2.2,-6.2 to 59.8,0.3; area 29.7,25 to 33.8,32.4

### Footprints (pad centres in the part's own frame; a part is rotated, then mirrored left to right if it is on the bottom)
BUTTON_PASSIVE_10MM = drill 0.356: BUTTON 0,4.064
0603-CAP = smd 1.1 x 1: 1 -0.85,0; 2 0.85,0
CHIP-LED0603 = smd 0.8 x 0.8: A 0,-0.75; C 0,0.75
ALS = smd 1 x 1.45: ANNODE 0.5,0; CATHODE 2.1,0
HUMIDITY = drill 1.016 pad 1.88: P$1 0,0; P$2 5.1,0
JMP-3-NO-PTH-2.54 = drill 1.016 pad 1.88: 1 0,0; 2 2.54,0; 3 5.08,0
096-SSD1306 = drill 1.016 pad 1.88: GND 9.8,25.6; SCL 14.88,25.6; SDA 17.42,25.6; VDD 12.34,25.6 | hole 2.88: 3.3,2.05; 24,2.05; 24,25.25; 3.3,25.25
1X05_LOCK = drill 1.016 pad 1.88: 1 0,0.127; 2 2.54,-0.127; 3 5.08,0.127; 4 7.62,-0.127; 5 10.16,0.127
SWITCH = smd 2 x 1.6: P$1 1,0.8; P$2 6.4,0.8
0603-RES = smd 1.1 x 1: 1 -0.85,0; 2 0.85,0
3386P = drill 0.813 pad 1.676 octagon: 1 -2.54,0; 2 0,-2.54; 3 2.54,0
R-5 = drill 0.813 octagon: 1 -2.54,0; 2 2.54,0
JMP-3-1_2 = smd 0.508 x 1.27: 1 -0.851,0; 2 0,0; 3 0.851,0
JMP-3-2_3 = smd 0.508 x 1.27: 1 -0.851,0; 2 0,0; 3 0.851,0
JMP-3-NO = smd 0.508 x 1.27: 1 -0.851,0; 2 0,0; 3 0.851,0
TQFP-7X7-48 = smd 1.3 x 0.21: 1 -4.4,2.75; 2 -4.4,2.25; 3 -4.4,1.75; 4 -4.4,1.25; 5 -4.4,0.75; 6 -4.4,0.25; 7 -4.4,-0.25; 8 -4.4,-0.75; 9 -4.4,-1.25; 10 -4.4,-1.75; 11 -4.4,-2.25; 12 -4.4,-2.75; 25 4.4,-2.75; 26 4.4,-2.25; 27 4.4,-1.75; 28 4.4,-1.25; 29 4.4,-0.75; 30 4.4,-0.25; 31 4.4,0.25; 32 4.4,0.75; 33 4.4,1.25; 34 4.4,1.75; 35 4.4,2.25; 36 4.4,2.75 | smd 0.21 x 1.3: 13 -2.75,-4.4; 14 -2.25,-4.4; 15 -1.75,-4.4; 16 -1.25,-4.4; 17 -0.75,-4.4; 18 -0.25,-4.4; 19 0.25,-4.4; 20 0.75,-4.4; 21 1.25,-4.4; 22 1.75,-4.4; 23 2.25,-4.4; 24 2.75,-4.4; 37 2.75,4.4; 38 2.25,4.4; 39 1.75,4.4; 40 1.25,4.4; 41 0.75,4.4; 42 0.25,4.4; 43 -0.25,4.4; 44 -0.75,4.4; 45 -1.25,4.4; 46 -1.75,4.4; 47 -2.25,4.4; 48 -2.75,4.4
UNO_R3_SHIELD_NOLABELS = drill 1.016 pad 1.88: 3.3V 50.8,26.67; 5V 50.8,29.21; A0 50.8,41.91; A1 50.8,44.45; A2 50.8,46.99; A3 50.8,49.53; A4 50.8,52.07; A5 50.8,54.61; AREF 2.54,15.24; D2 2.54,49.53; D3 2.54,46.99; D4 2.54,44.45; D5 2.54,41.91; D6 2.54,39.37; D7 2.54,36.83; D8 2.54,33.02; D9 2.54,30.48; D10 2.54,27.94; D11 2.54,25.4; D12 2.54,22.86; D13 2.54,20.32; GND@0 50.8,31.75; GND@1 50.8,34.29; GND@2 2.54,17.78; IOREF 50.8,21.59; NC 50.8,19.05; RES 50.8,24.13; RX 2.54,54.61; SCL 2.54,10.16; SDA 2.54,12.7; TX 2.54,52.07; VIN 50.8,36.83

### Placement (x,y rotation side)
B0  49.25,16.18 90 top
B1  49.25,31.18 90 top
B2  49.25,46.18 180 top
B3  49.25,61.18 180 top
C1  19,17.82 0 top
C2  19,19.5 0 top
C3  19.76,27.43 270 top
C4  21.16,27.43 270 top
C5  28.7,11.13 270 top
C6  30.1,11.13 270 top
C7  22.56,27.43 270 top
C8  23.95,27.43 270 top
C9  25.35,27.43 270 top
C10  16.5,14.7 270 top
C11  23.85,11.28 90 top
C12  28.14,27.43 90 top
C13  25.48,11.46 270 top
C14  26.75,27.43 90 top
C15  36.22,19.97 180 top
C16  15.24,53.76 270 top
C17  33.73,37.59 180 top
CLED0  40.5,16.28 180 top
CLED1  40.5,31.18 0 top
CLED2  40.5,46.18 0 top
CLED3  40.5,61.18 0 top
D1  27.09,12.78 270 top
HUMIDITY  13.37,12.44 180 top
J5  39.57,41.68 270 top
J6  37.97,23.98 90 top
J7  25.73,37.14 90 top
LED1  24.98,55.32 0 top
LED2  25.02,65.17 0 top
MB1  30.95,54.41 0 top
MB2  30.95,64.01 0 top
PROX  37.59,10.61 90 top
R1  35.79,14.55 0 top
R2  16.75,60.02 0 top
R3  42.25,16.18 270 top
R4  42.25,31.18 90 top
R5  42.25,46.18 90 top
R6  42.25,61.18 90 top
R7  28.21,55.25 90 top
R8  28.21,65.12 90 top
R9  33.99,61.6 0 top
R10  33.97,59.32 0 top
R11  35.78,12.92 0 top
R12  17.85,14.7 270 top
R13  32.24,25.95 0 top
R14  32.28,27.89 0 top
R15  32.28,29.51 0 top
R16  32.24,31.5 0 top
R17  57.34,49.22 180 top
R18  21.01,49.1 0 top
R19  20.98,45.31 180 bottom
R20  21.01,47.7 0 top
R21  20.98,46.53 180 bottom
R22  36.22,21.37 180 top
R23  34.64,10.61 0 top
R24  30.66,6.14 180 top
R25  24.76,4.48 90 top
R26  25.3,50.29 180 top
R27  34.44,6.81 180 top
R30  15.03,36.28 90 top
R31  15.11,32.83 90 top
R32  41.68,39.21 90 top
U7  26.48,18.58 0 top
U$1  6.22,9.69 0 top
U$7  64.65,1.22 90 top

### Tracks (layer width: path | path; a pad name or v marks a point on that pad's centre or on a via)
A0
  Top 0.381: U$1.A0 58.19,50.43 R17.1
CAP-PROX
  Top 0.152: 24.72,1.78 24.73,3.82 24.76,3.79 R25.1
  Top 1.524: 24.72,1.78 1.78,1.78 1.78,72.54 64.03,72.54 64.03,1.78 24.72,1.78
CAP-PSOC
  Top 0.152: U7.15 24.73,5.36 R25.2
CB0
  Top 0.152: R13.1 29.77,24.33 28.22,24.33 28.23,24.32 U7.39
CB1
  Top 0.152: R14.1 28.18,24.64 28.09,24.64 27.73,24.27 U7.40
CB2  (via drill 0.35)
  Top 0.152: R15.1 30.01,29.51 30.01,29.5 v30.03,29.48 | U7.7 24.48,18.33 v24.52,18.37
  Bottom 0.152: v24.52,18.37 26.28,18.37 27.52,19.6 27.52,26.96 v30.03,29.48
CB3  (via drill 0.33)
  Top 0.152: R16.1 31.32,31.43 v30.15,31.43 30.01,31.43 | U7.4 22.16,19.75 v24.07,19.75
  Bottom 0.152: v30.15,31.43 26.46,27.75 26.46,20.62 25.58,19.75 v24.07,19.75
CBLED0  (via drill 0.33)
  Top 0.152: v41.3,18.06 42.21,17.15 R3.1 | v26.67,17.91 25.91,17.91 24.84,18.97 22.25,18.97 22.1,18.82 U7.6
  Bottom 0.152: v41.3,18.06 26.82,18.06 v26.67,17.91
CBLED1  (via drill 0.33)
  Top 0.152: v40.54,19.74 40.54,28.58 42.21,30.25 R4.1 | v20.88,18.67 21.18,18.97 21.18,19.13 21.34,19.28 21.95,19.28 U7.5
  Bottom 0.152: v40.54,19.74 41.91,18.36 41.91,17.75 41.61,17.45 36.58,17.45 36.27,17.75 27.43,17.75 26.97,17.3 22.25,17.3 v20.88,18.67
CBLED2  (via drill 0.33)
  Top 0.152: v28.65,45.95 36.27,45.95 36.42,46.1 41,46.1 41.76,45.34 42.21,45.34 R5.1 | v18.9,13.03 20.42,13.03 23.01,15.62 23.01,16.54 22.71,16.84 22.1,16.84 U7.10
  Bottom 0.152: v28.65,45.95 26.06,48.54 17.98,48.54 17.19,47.75 16.72,47.75 10.06,41.08 10.06,37.26 9.14,36.35 8.23,36.35 6.86,34.98 6.86,20.04 12.99,13.91 13.98,13.91 14.4,13.49 18.44,13.49 v18.9,13.03
CBLED3  (via drill 0.33)
  Top 0.152: v30.02,49.15 33.53,49.15 38.71,54.33 38.71,56.77 42.21,60.27 R6.1 | v18.29,12.42 20.88,12.42 23.62,15.16 24.84,15.16 25.15,14.86 25.15,14.25 U7.16
  Bottom 0.152: v30.02,49.15 16.92,49.15 9.14,41.38 8.23,41.38 6.55,39.7 6.55,19.89 12.84,13.61 13.85,13.61 14.28,13.18 17.53,13.18 v18.29,12.42
CMESH  (via drill 0.35)
  Top 0.152: R24.1 31.99,6.23 v32.59,5.63
  pour Bottom (hatched): 28.6,5.59 60.22,5.59 60.22,68.73 5.59,68.73 5.59,5.59 28.57,5.59 28.57,1.02 1.02,1.02 1.02,73.3 64.8,73.3 64.8,1.02 28.6,1.02
CMOD
  Top 0.203: C12.1 27.75,26.39 27.75,25.46 27.23,24.94 U7.41
CSHIELD  (via drill 0.33, 0.35)
  Top 0.152: U7.23 v28.73,13.02 | v28.72,6.27 29.78,6.27 R24.2
  Bottom 0.152: v28.73,13.02 28.73,7.3 v28.72,6.27
CTANK
  Top 0.203: C14.1 26.73,26.55 U7.42
D4  (via drill 0.33)
  Top 0.152: v32.16,18.82 30.94,18.82 U7.31
  Bottom 0.152: v32.16,18.82 32.16,23.7 33.22,24.77 33.83,24.77 33.99,24.92 33.99,32.39 33.83,32.54 32,32.54 26.06,38.48 25.3,38.48 24.54,39.24 24.54,40.16 25.3,40.92 26.06,40.92 30.63,45.49 30.63,49.45 30.02,50.06 9.45,50.06 9.14,50.37 8.23,50.37 7.47,51.13 7.47,52.81 8.69,54.03 U$1.D4
D5  (via drill 0.33, 0.35)
  Top 0.152: v32.77,20.19 32.46,19.89 30.94,19.89 U7.33 | v36.73,24.46 v35.51,23.24 | R26.2 v24.45,51.73 v24.46,51.74
  Bottom 0.152: v32.77,20.19 32.77,20.5 v35.51,23.24 | v36.73,24.46 37.34,24.46 37.64,24.16 55.17,24.16 58.52,27.51 58.52,64.85 55.47,67.89 41.45,67.89 35.36,61.8 35.36,57.99 29.11,51.74 v24.46,51.74 8.84,51.74 U$1.D5
D11  (via drill 0.33, 0.35)
  Top 0.152: v35.81,11.66 37.49,13.34 37.49,16.38 33.07,20.8 30.94,20.8 U7.35 | v27.73,6.25 28.64,7.16 v31.08,7.16 31.1,7.14 32.23,7.14 32.56,6.81 R27.2
  Bottom 0.152: U$1.D11 8.69,34.98 7.16,33.45 7.16,22.33 8.38,21.11 11.73,21.11 26.59,6.25 v27.73,6.25 | v35.81,11.66 35.61,11.66 31.14,7.19 31.12,7.19 v31.08,7.16
D12  (via drill 0.33)
  Top 0.152: v29.72,18.67 30.02,18.36 30.78,18.36 U7.30 | v28.5,18.67 28.5,18.06 v29.41,17.15 | v20.73,16.84 10.06,16.84 7.47,19.43 7.47,31.32 8.69,32.54 U$1.D12
  Bottom 0.152: v28.5,18.67 v29.72,18.67 | v29.41,17.15 27.28,17.15 26.97,16.84 v20.73,16.84
D13  (via drill 0.33)
  Top 0.152: v27.74,15.77 27.74,14.25 U7.21
  Bottom 0.152: v27.74,15.77 27.74,15.47 28.04,15.16 28.04,7.24 27.31,7.24 27.29,7.22 26.81,7.22 26.8,7.23 26.07,7.23 9.6,23.7 8.23,23.7 7.47,24.46 7.47,28.73 8.69,29.95 U$1.D13
FUTUREARD  (via drill 0.33)
  Top 0.152: v28.65,15.47 28.19,15.01 28.19,14.25 U7.22 | v29.41,8.92 26.97,6.48 v25.45,6.48
  Bottom 0.152: v28.65,15.47 28.65,13.94 29.41,13.18 v29.41,8.92 | v25.45,6.48 18.29,6.48 13.5,11.27 12.88,11.27 12.2,11.95 12.2,12.57 6.25,18.52 6.25,56.77 8.69,59.21 U$1.D2
GND  (via drill 0.33, 0.35, 0.79 pad 1.6)
  Top 0.152: U$1.GND@1 57,43.97 57,41.53 U$1.GND@0 57.15,41.38 57.15,40.46 | 41.61,9.37 41.63,9.42 | 42.98,25.83 v42.88,25.75 | v39.32,47.93 42.08,47.93 | 15.7,32.08 15.24,32.08 15.12,32.02 R31.1 | R27.1 38.98,6.81 v41.76,9.59 | 36.92,20.05 C15.1
  Top 0.254: U7.44 25.73,21.74 v25.75,21.72 25.63,21.84 24.74,21.84 24.73,21.85 U7.46 | U7.9 24.33,17.33 v25.98,15.67 26.23,15.43 U7.18 | U7.27 33.23,16.83 33.54,17.14
  Top 0.762: C13.2 25.68,9.81 25.51,9.64 25.51,8.91 26.03,8.39 26.46,8.39 v27.05,7.8 27.05,8.23 28.67,9.85
  Top 1.016: C5.2 C6.2
  Bottom 0.152: 42.98,25.83 v42.88,25.75 | 57,41.38 U$1.GND@0
  Bottom 0.254: v27.05,7.8 27.05,14.61
  Bottom 0.762: 33.54,17.14 36.02,17.14 38.3,14.86 38.3,12.94 R11.2 38.32,11.05 39.84,9.53 | v25.75,21.72 25.75,29.94 25.76,29.96
  Bottom 1.27: v25.98,15.67 20.29,15.67 10.49,25.48 10.49,25.64 8.76,27.37 U$1.GND@2
  Bottom 1.524: 27.05,14.61 v25.98,15.67
  other vias: 11.02,66.07 42.98,10.13 34.2,42 34.82,44.65 38.51,47.4 40.62,66.14 45.21,66.85 42.56,54.62 43.39,56.59 43.4,23.26 43.81,27.02 45.16,25.81 57.02,19.24 55.27,11.8 43.17,13.03 41.7,21.72 41.78,27.05 14.27,50.72 13.84,37.68 55.26,34.91 43.31,34.86 43.97,55.27 55.05,56.62 43.53,53.22 34.29,42.9 26.36,30.13 26.36,31.74 23.81,30.23 23.73,32.76 22.38,31.61 20.13,10.88 21.89,9.01 17.32,8.78 15.45,10.83 12.13,10.8 13.38,9.47 10.24,12.9 10.57,17.96 11.29,19.74 12.77,18.62 12.75,22.58 15.45,19.97 14.48,15.73 12.9,15.63 33.13,57.59 24.9,61.12 33.73,63.13 34.62,65.8 28.32,63.05 22.5,12.22 23.93,21.63 19.8,30.38 19.78,32.81 19.46,36.77 19.63,39.96 22.88,39.38 23.03,43.39 19.41,38.45 19.8,31.63 19.59,41.14 16.1,30.52 15.19,26.3 15.72,24.78 39.35,53.05 41.3,53.01 41.38,50.73 41.41,49.29 26.7,54.19 20.5,53.69 22.02,58.31 22.35,56.58 14.01,52.55 13.98,53.39 43.36,66.76 42.31,64.48 54.32,54.54 53.25,52.98 20.26,65.87 18.48,64.03 16.89,62.44 13.83,57.41 14.09,55.5 57.15,15.48 45.24,10.65 30.71,40.4 30.89,38.63 29.2,39.53 28.9,40.92 31.45,43.19 31.7,44.18 35.3,17.1 36.46,16.45 16.68,18.76 34.16,17.09 38.44,23.26 38.27,20.74 38.2,22.02
  pour Bottom (rank 2, no thermals, hatched): 42.87,67.33 59.59,67.36 59.59,7.39 42.82,7.39 42.82,66.88
  pour Top (isolate 0.203, rank 2): 7.01,66.83 42.8,66.83 42.8,8.03 7.01,8.03
  pour Bottom (isolate 0.203): 7.01,66.83 42.8,66.83 42.8,8.28 7.01,8.28
  pour Top (rank 2, no thermals, hatched): 42.87,67.73 55.65,67.76 55.58,9.64 42.78,9.61 42.82,66.88
  pour Top (rank 2, no thermals, hatched): 42.12,66.79 58.84,66.81 42.08,66.33
H-REF-CAP
  Top 0.152: U7.14 24.25,14.15 24.25,13.17 23.85,12.77 C11.2
HUMIDITY
  Top 0.152: U7.13 23.77,14.1 23.01,14.1 20.73,11.81 14.02,11.81 13.41,12.42 HUMIDITY.P$1
LED1  (via drill 0.33)
  Top 0.152: v27.58,48.54 28.19,49.15 28.19,54.33 R7.1 | v29.26,27.81 29.26,28.42 29.27,28.43 29.27,29.09 28.41,29.95 v27.74,29.95 | v29.72,20.65 30.02,20.35 30.78,20.35 U7.34
  Bottom 0.152: v27.58,48.54 27.58,47.93 29.26,46.25 29.26,45.64 27.13,43.51 25.15,43.51 24.23,42.6 24.23,36.04 27.74,32.54 v27.74,29.95 | v29.26,27.81 29.26,21.11 v29.72,20.65
LED2  (via drill 0.33)
  Top 0.152: v30.33,64.39 28.35,64.39 R8.1 | v44.35,23.24 43.74,23.85 42.82,23.85 v41.15,25.53 | v38.4,25.53 38.4,25.22 38.56,25.07 38.56,24.46 v36.73,22.63 | v33.53,19.43 30.94,19.43 U7.32
  Bottom 0.152: v30.33,64.39 37.03,64.39 41.15,68.5 55.78,68.5 59.13,65.15 59.13,27.2 55.17,23.24 v44.35,23.24 | v38.4,25.53 v41.15,25.53 | v33.53,19.43 v36.73,22.63
MB1  (via drill 0.33)
  Top 0.152: 34.9,58.29 34.9,57.68 36.27,56.31 | 34.9,58.29 34.9,59.21 R10.2 | 36.27,56.31 37.34,55.25 MB1.P$2 | v34.29,18.67 32.92,17.3 30.94,17.3 U7.28 | v40.39,18.67 41.76,20.04 v41.76,20.8 | 34.9,58.29 v34.75,58.29 | 36.27,56.31 26.06,46.1 25.45,46.1 24.38,45.03 24.38,39.4 25.45,38.33 25.45,37.26 J7.1
  Bottom 0.152: v40.39,18.67 v34.29,18.67 | v41.76,20.8 42.52,21.56 42.52,23.24 43.13,23.85 55.32,23.85 58.83,27.36 58.83,65 55.63,68.2 41.3,68.2 34.75,61.65 v34.75,58.29
MB2  (via drill 0.33)
  Top 0.152: MB2.P$2 37.34,64.69 34.9,62.26 34.9,61.65 R9.2 34.9,61.49 35.66,61.49 v35.97,61.19 | v34.59,31.62 37.95,28.27 37.95,26.59 34.59,23.24 31.39,23.24 29.11,20.96 29.11,18.36 29.57,17.91 30.78,17.91 U7.29 | v34.59,36.2 29.26,36.2 25.91,39.55 J7.2
  Bottom 0.152: v34.59,36.2 v34.59,31.62 | v35.97,61.19 35.97,55.09 30.94,50.06 30.94,44.73 25.91,39.7 J7.2
N$2  (via drill 0.33)
  Top 0.152: R13.2 33.11,25.93 v33.11,23.84
  Bottom 0.152: 33.09,23.84 v33.11,23.84 37.53,23.84 37.86,23.5 37.86,23.02 37.87,23.01 37.87,22.77 38.04,22.6 38.45,22.6 38.52,22.52 38.92,22.52 45.18,16.26 B0.BUTTON
N$3
  Top 0.254: R23.2 PROX.C
N$5  (via drill 0.33)
  Top 0.152: R14.2 34.42,29.17 35.16,29.17 v35.38,29.4
  Bottom 0.152: B1.BUTTON 43.18,29.17 35.61,29.17 v35.38,29.4
N$7  (via drill 0.33)
  Top 0.152: v33.99,33.6 33.99,31.01 33.22,30.25 33.22,29.64 R15.2
  Bottom 0.152: v33.99,33.6 33.99,38.33 39.01,43.36 48.01,43.36 49.23,42.14 B2.BUTTON
N$8
  Top 0.254: CLED0.C 40.7,15.33 R3.2
N$9
  Top 0.152: CLED1.C 40.54,31.93 42.21,31.93 R4.2
N$10
  Top 0.254: CLED2.C 40.6,47.03 R5.2
N$11
  Top 0.254: CLED3.C 40.6,62.03 R6.2
N$12
  Top 0.254: LED1.C 25.01,56.1 R7.2
N$13
  Top 0.254: LED2.C 25.07,65.97 R8.2
N$14
  Top 0.381: R30.2 14.99,36.32 J6.VDD
N$15  (via drill 0.33)
  Top 0.152: v33.07,33.17 33.09,33.15 R16.2
  Bottom 0.152: B3.BUTTON 43.93,51.79 33.16,51.79 32.71,51.34 32.71,33.8 33.07,33.43 v33.07,33.17
N$17
  Top 0.381: R31.2 15.11,32.84 13.78,32.84 12.85,33.78 J6.GND
N$20
  Top 0.203: U7.45 25.23,24.34 25.22,24.34 23.85,24.34 22.69,25.5 22.69,26.45 C7.2
POT  (via drill 0.33)
  Top 0.152: 58.06,57.68 57.15,56.77 U$1.A2 | 58.06,57.68 58.22,57.84 58.22,62.26 57.45,63.02 56.54,63.02 55.78,63.78 55.78,64.24 52.04,67.97 52.02,67.95 42.3,67.95 41.65,67.3 24.91,67.3 17.58,59.97 17.58,58.31 R2.2 | 16.76,57.53 R2.2 | v29.87,13.64 29.72,13.64 29.26,14.1 U7.24 | v59.74,55.85 58.52,57.07 58.52,57.23 58.06,57.68 | R2.2 16.75,56.12 C16.1
  Bottom 0.152: v29.87,13.64 32.77,13.64 32.92,13.79 34.59,13.79 39.47,8.92 54.86,8.92 59.74,13.79 v59.74,55.85
PROXLED
  Top 0.152: R23.1 33.68,10.74 29.57,14.86 29.57,15.47 28.69,16.35 27.5,16.35 27.17,16.01 27.17,15.54 27.23,15.47 U7.20
SCL  (via drill 0.33)
  Top 0.152: v18.59,45.19 18.44,45.34 18.44,47.47 19.81,48.84 20.12,48.84 R18.1 | v26.82,19.89 29.26,22.33 29.26,22.94 U7.37 | U$1.SCL 8.84,19.89 8.84,20.8 10.82,22.78 10.82,37.26 12.34,38.79 J6.SCL
  Bottom 0.152: R19.1 20.12,45.19 v18.59,45.19 16.61,45.19 13.56,42.14 13.56,40.01 12.5,38.94 J6.SCL 12.5,38.79 12.5,38.18 13.56,37.11 13.56,29.34 23.77,19.13 25.45,19.13 26.21,19.89 v26.82,19.89
SDA  (via drill 0.33)
  Top 0.152: v19.05,46.56 20.12,47.63 R20.1 | v24.99,21.11 27.58,21.11 28.65,22.17 28.65,22.94 U7.38 | U$1.SDA 8.84,22.48 8.84,23.24 10.52,24.92 10.52,39.55 12.34,41.38 J6.SDA
  Bottom 0.152: 19.05,46.41 17.37,46.41 12.5,41.53 J6.SDA | 19.05,46.41 20.12,46.41 R21.1 20.27,46.56 21.03,45.8 21.03,44.73 21.64,44.12 21.64,38.18 24.99,34.82 v24.99,21.11 | 19.05,46.41 v19.05,46.56
THERM-MID
  Top 0.152: R11.1 33.24,14.42 33.37,14.56 R1.1
  Top 0.254: R11.1 30.88,15 U7.25
THERM-REF-HIGH
  Top 0.152: 36.32,14.55 R1.2 36.64,13.66 35.07,12.09 33.85,12.09 | U7.3 25.33,20.33 30,15.67 30,15.38 30.82,14.55 30.82,14.03 33.29,11.57 33.8,12.09 33.85,12.09 | 33.85,12.09 33.84,12.08
  Top 0.254: U7.26 34.87,16.33 34.88,16.33 35.47,16.33 36.64,15.17 R1.2
TIA_IN  (via drill 0.35)
  Top 0.152: C10.1 16.61,15.62 17.83,15.62 R12.1 17.98,15.62 18.59,16.23 19.44,16.23 | 19.44,16.23 21.95,16.23 U7.11 | v26.4,9.28 26.36,9.24 27.16,10.04 27.16,10.61 D1.CATHODE | v19.39,14.96 19.39,16.19 19.44,16.23
  Bottom 0.152: v26.4,9.28 24.64,9.28 21.93,11.98 21.93,12.39 19.39,14.93 v19.39,14.95 v19.39,14.96
TIA_OUT
  Top 0.152: R12.2 17.83,13.94 16.61,13.94 C10.2 16.46,13.94 12.5,13.94 7.16,19.28 7.16,64.39 11.73,68.96 57.15,68.96 60.66,65.46 60.66,49.61 59.13,48.08 57,48.08 56.54,48.54 56.54,49.15 R17.2 | 21.95,15.77 U7.12 20.1,13.85 R12.2 | 17.98,13.94 R12.2
UARTRX  (via drill 0.33, 0.35)
  Top 0.152: U7.48 22.53,22.98 v21.05,24.46 20.99,24.51 | v10.67,61.65 10.67,46.56 14.94,42.29 v15.85,42.29
  Bottom 0.152: v21.05,24.46 21.05,42.29 v15.85,42.29 | v10.67,61.65 8.87,61.65 U$1.TX
UARTTX  (via drill 0.33)
  Top 0.152: v21.18,22.63 21.95,21.87 21.95,21.41 U7.1 | v14.48,41.83 14.48,42.29 10.06,46.71 10.06,63 U$1.RX
  Bottom 0.152: v21.18,22.63 21.18,22.94 14.48,29.64 v14.48,41.83
V33
  Top 0.152: 41.37,38.4 R32.1 41.68,36.6
  Top 1.016: 41.68,36.6 J5.3
  Bottom 0.152: J5.3 39.75,36.6 40,36.36
  Bottom 1.524: U$1.3.3V 40,36.36 39.62,36.74
  pour Top (no thermals): 41.22,36.17 42.09,36.17 42.09,38.27 41.22,38.27
V50
  Top 0.152: 41.64,41.68 41.68,41.64 41.68,40.03 R32.3
  Top 1.016: J5.1 41.64,41.68
  Bottom 0.152: J5.1 39.57,41.78 39.62,41.82
  Bottom 1.524: 39.62,41.82 40.3,41.14 40.38,41.14 42.62,38.9 U$1.5V
  pour Top (no thermals): 41.26,40.05 42.14,40.05 42.14,42.14 41.26,42.14
VCC  (via drill 0.33)
  Top 0.152: 21.95,47.63 R20.2 21.95,47.78 21.95,48.84 R18.2 21.79,49 | LED1.A 24.84,54.64 20.88,54.64 19.96,55.55 19.29,55.81 | C5.1 28.65,12.12 28.49,12.28 | 36.28,37.59 36.4,37.47 | R22.1 39.57,21.37 39.63,21.42 | 30.1,12.05 C6.1 | C2.2 19.82,19.53 | 39.59,39.26 39.63,39.21 39.7,39.21 39.63,39.14 J5.2 | 27.4,11.98 D1.ANNODE 26.73,12.64 | 15.03,33.74 15.12,33.65 R31.3 | 15.4,35.09 15.03,35.46 R30.1
  Top 0.254: U7.43 26.24,25 25.45,25.79 C9.2 | R10.1 33.14,59.34 33.14,60.5 | 33.14,60.5 R9.1 32.48,62.25 22.85,62.25 | CLED2.A 40.16,45.09 36.37,45.09 36.36,45.08 36.36,39.26 | U7.47 24.11,23.09 24.11,23.74 23.95,23.91 23.3,23.91 21.72,25.48 | U7.8 C1.2 | 26.73,12.64 U7.19 | 33.14,60.5 33.21,60.43 CLED3.A
  Top 0.508: 15.03,35.46 15.03,33.74
  Top 0.635: 39.7,39.21 R32.2
  Top 0.762: v21.74,25.46 21.72,25.48 C4.2 | CLED1.A 38.95,28.88 38.95,28.51 | 15.4,35.09 17.58,35.09 | C6.1 C5.1 27.4,11.98 | 32.05,10.33 32.05,11.11 31.11,12.05 30.1,12.05
  Top 1.016: C9.2 C8.2 v23.95,25.48 | C4.2 C3.2 17.62,26.58 17.58,26.62 | 19.82,19.53 19.82,22.73 | C17.1 36.28,37.59 | J7.5 22.27,47.3 21.95,47.63 | R18.2 21.86,50.2 21.03,51.03 17.34,51.03 17.21,51.16 | C1.2 C2.2
  Top 1.27: 39.62,39.28 39.59,39.26 36.36,39.26 36.4,39.21 36.4,37.47 36.4,34.91 36.4,31.05 38.95,28.51 39.63,27.83 39.63,21.42 39.63,20.42 39.26,20.05 39.26,18.2 39.28,18.18 39.28,16.96 | CLED0.A 40.44,16.96 39.28,16.96 | 39.28,16.96 38.37,16.96 38.37,14.92 41.15,12.14 41.15,10.68 38.41,10.68 PROX.A 38.34,9.17 38.27,9.1 32.11,9.1 32.05,9.05 32.05,10.33
  Top 1.524: 39.63,39.3 39.62,39.28 | 19.82,22.73 17.58,24.97 17.58,26.62 17.58,35.09 | 17.58,35.09 17.76,34.91 36.4,34.91 | 17.58,35.09 17.21,35.46 17.21,51.16 17.21,53.73 19.29,55.81 R2.3 20.62,60.02 22.85,62.25 LED2.A
  Bottom 0.152: R19.2 21.79,45.34 21.79,46.41 R21.2 21.95,46.56 24.54,46.56 25.15,47.17 25.45,47.17 J7.5
  Bottom 0.762: v21.74,25.46 21.77,25.48 v23.95,25.48
VDAC  (via drill 0.33)
  Top 0.152: v22.4,22.33 23.01,21.72 23.01,21.11 22.71,20.8 22.1,20.8 U7.2 | U$1.A1 57.15,54.18 57.91,54.18 58.67,54.94 59.74,54.94 60.35,55.55 60.31,55.59 60.31,56.09 59.28,57.13 59.28,62.48 58.19,63.57 58.19,64.78 54.56,68.41 42.08,68.41 41.56,67.89 23.29,67.89 15.28,59.88 15.28,59.58 | 15.24,59.54 15.28,59.58 | 15.28,59.58 15.28,57.5 11.88,54.11 11.88,51.72 15.24,48.36 v15.24,42.9
  Bottom 0.152: v22.4,22.33 20.88,23.85 20.73,23.85 15.24,29.34 v15.24,42.9
VREF
  Top 0.152: U7.17 25.73,12.56 C13.1
XRES  (via drill 0.33)
  Top 0.152: R22.2 34.9,21.41 31.55,21.41 31.39,21.26 30.94,21.26 U7.36 | 35.36,21.37 35.05,21.41 35.22,21.24 | 35.36,21.37 R22.2 | v35.2,38.63 31.7,42.14 25.6,42.14 J7.3 | v37.95,24.77 37.95,24.66 36.16,22.87 36.15,22.87 35.37,22.09 35.37,21.39 35.36,21.37 | R22.2 C15.2
  Bottom 0.152: v37.95,24.77 55.32,24.77 55.78,25.22 55.78,32.54 57,33.76 U$1.RES 57.15,33.91 58.22,34.98 58.22,36.96 57.61,37.57 42.52,37.57 42.11,37.98 39.09,37.98 38.43,38.63 v35.2,38.63

### Text on the board
tPlace: PSoC CapSense Proximity Loop | 4 | PSoC | Therm | D1 | Humidity | PSoC AFE Shield / V2.2 | ALS
tNames: GND | J4 | RX:D0 | MB2 | 1 | TX:D1 | D2 | A2:POT | MB1 | MB1:D4 | A1:DAC | LED1:D5 | 1 | J2 | A0:ALS | J1 | 1 | GND | J3 | 1 | J6 | V50 | GND | V50 | GND | V33 | LED2:D11 | V33 | MB2:D12 | VPWR | GND | INT:D13 | SDA | SCL
bNames: PSoC Function / P12 VDAC ARD-A1 / P13 Therm Ref / P14 CapSense B3 / P15 CapLED 1 / P16 CapLED 0 / P17 CapSense B2 / P20 CapLED 2 / P21 TIAIN / P22 TIAOUT ARD-A0 / P23 Humidity | PSoC Function / P00 MB2/SDAT / P01 MB1/SCLK / P02 D12 / P03 D4 / P04 LED2 / P05 D5 / P06 LED1 / P07 D11 / P10 ARD-RX / P11 ARD-TX | VPWR | GND | XRES | SCLK | SDAT | PSoC Function / P24 Humidity Ref Cap / P25 Proximity / P26 CapLED 3 / P27 SAR Bypass / P30 PROX LED / P31 D13 / P32 D2 / P33 Prox Shield / P34 Pot ARD-A3 | PSoC Function / P35 Therm Mid / P36 Therm Ref / P37 Therm Low (GND) / P40 SCL / P41 SDA / P50 CapSense B0 / P51 CapSense B1 / P52 CMOD / P53 CTANK | QR / CODE | BAR CODE | 600-60500-01 REV2.2